# Altium project DK2.PRJPCB (part 1 of 2)
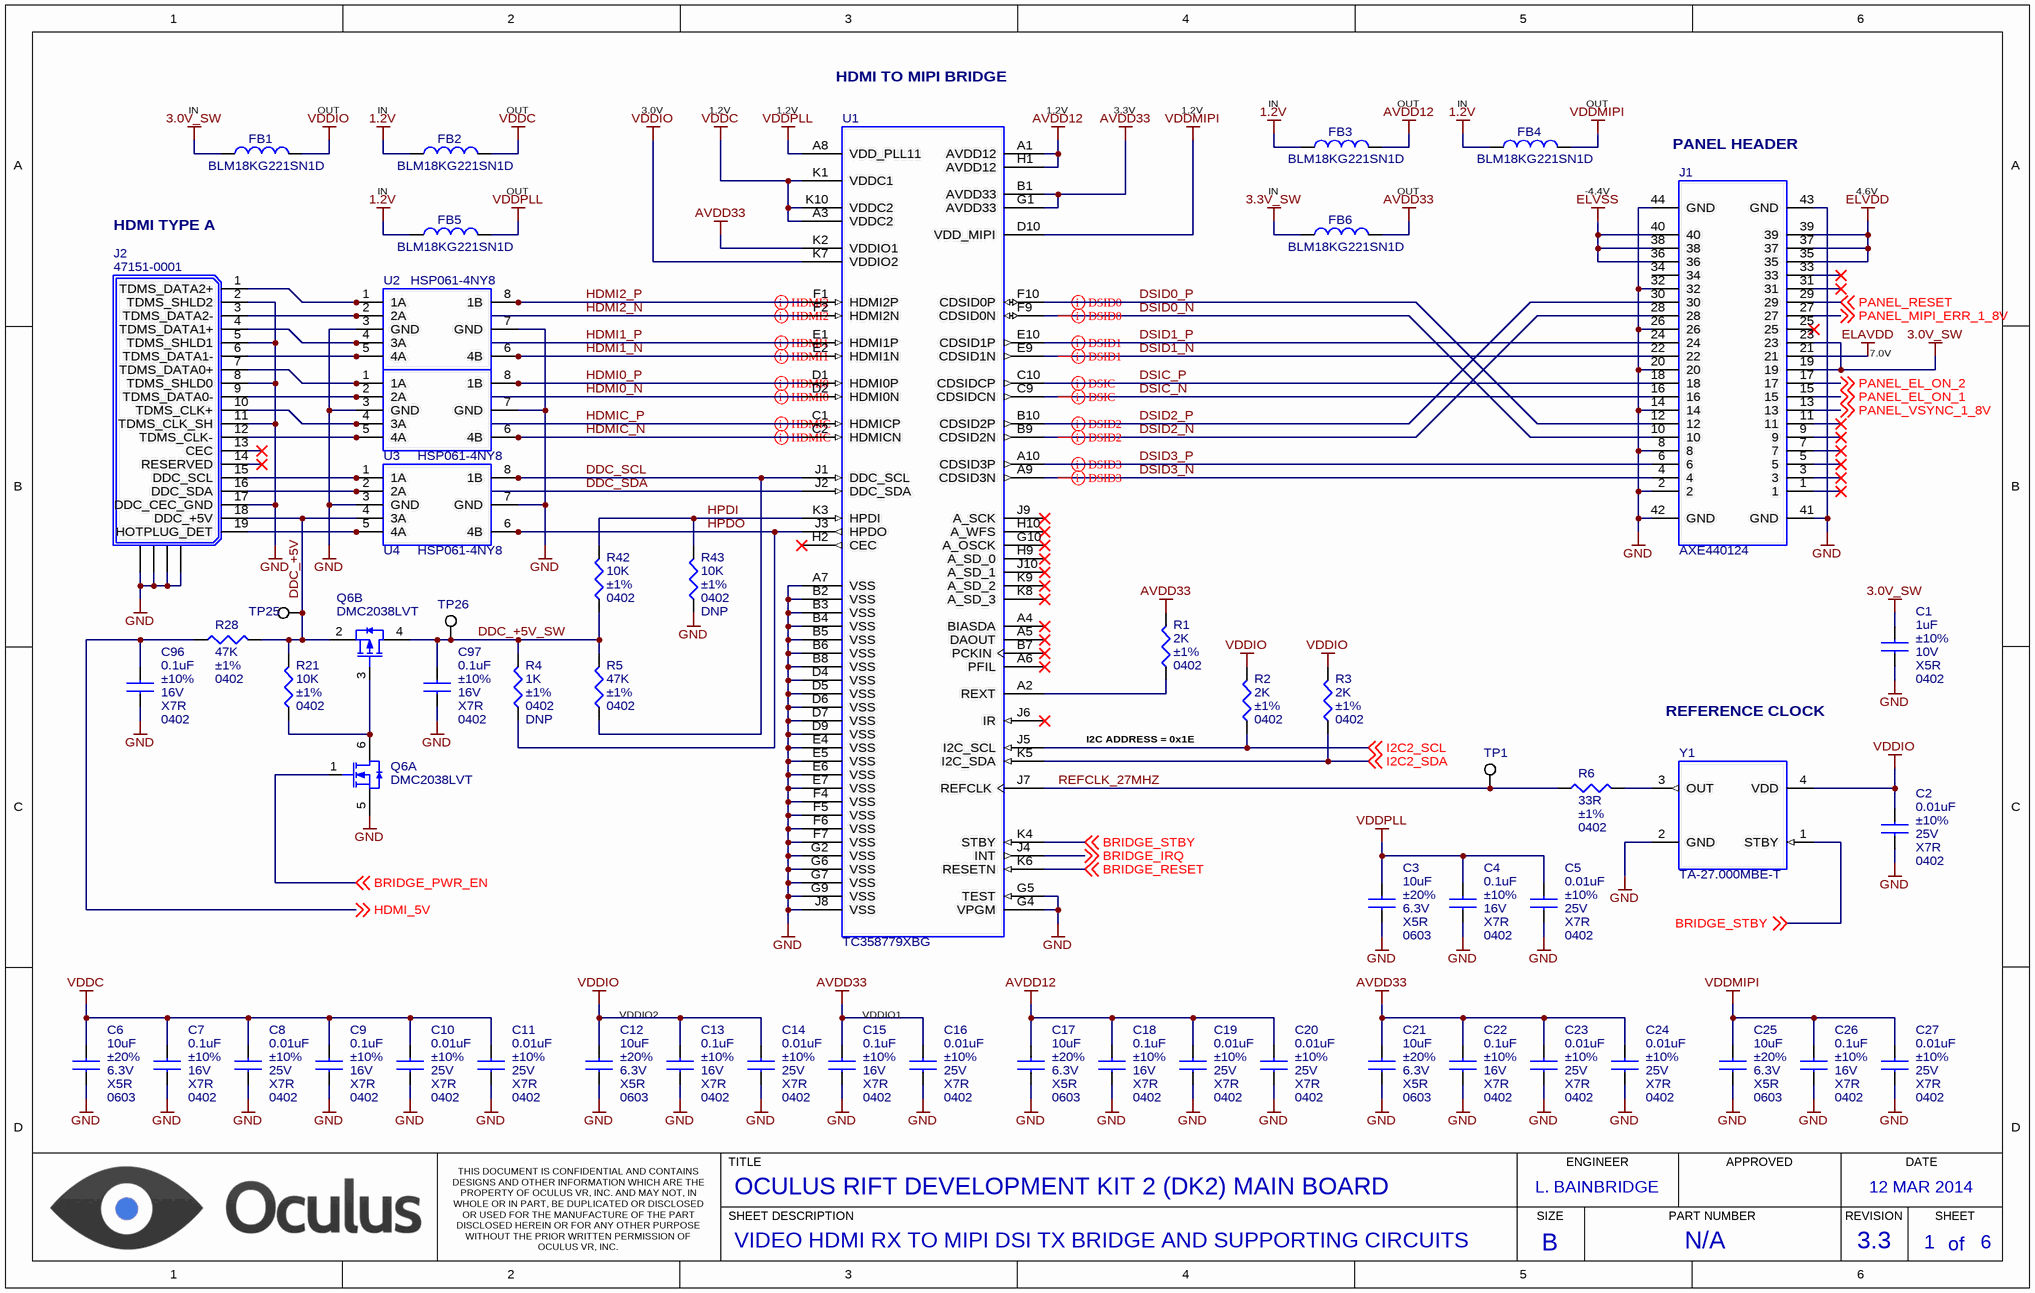
[diagram p0: VIDEO.SchDoc]
Date: 5 Jan 2014
6 sheets, 275 parts. Net scope: global (net labels, ports and power ports of the same name join across sheets).
Board file: DK2.PcbDoc
Sheets:
  VIDEO.SchDoc
  MICRO.SchDoc
  USBHUB.SchDoc
  SENSOR.SchDoc
  POWER.SchDoc
  IRLED.SchDoc

## Sheet VIDEO.SchDoc: OCULUS RIFT DEVELOPMENT KIT 2 (DK2) MAIN BOARD
size B; Date: 12 MAR 2014; Author: L. BAINBRIDGE; CompanyName: Oculus VR, Inc.; DrawnBy: L. BAINBRIDGE; Engineer: L. BAINBRIDGE; Organization: Oculus VR, Inc.; DocumentNumber: 1; Revision: 3.3; SheetNumber: 1; SheetTotal: 6; PageSetup: Record=PageOptions|CenterHorizontal=True|CenterVertical=True|PrintScale=1.12|XCorrection=1.00|YCorrection=1.00|PrintKind=1|BorderSize=5000000|LeftOffset=0|BottomOffset=0|Orientation=2|PaperLength=1000|PaperWidth=1000|Scale=100|PaperSource=15|PrintQuality=1200|MediaType=1|DitherType=0|PaperKind=11 x 17|PrintScaleMode=1; SheetDescription: VIDEO HDMI RX TO MIPI DSI TX BRIDGE AND SUPPORTING CIRCUITS; PartNumber: N/A; ProjectName: DK2

### Parts
C1  1uF  Tolerance: ±10%  Voltage: 10V  Dielectric: X5R  Package: 0402  [CAP_CERAMIC_0402]
C2  0.01uF  Tolerance: ±10%  Voltage: 25V  Dielectric: X7R  Package: 0402  [CAP_CERAMIC_0402]
C3  10uF  Tolerance: ±20%  Voltage: 6.3V  Dielectric: X5R  Package: 0603  [CAP_CERAMIC_0603]
C4  0.1uF  Tolerance: ±10%  Voltage: 16V  Dielectric: X7R  Package: 0402  [CAP_CERAMIC_0402]
C5  0.01uF  Tolerance: ±10%  Voltage: 25V  Dielectric: X7R  Package: 0402  [CAP_CERAMIC_0402]
C6  10uF  Tolerance: ±20%  Voltage: 6.3V  Dielectric: X5R  Package: 0603  [CAP_CERAMIC_0603]
C7  0.1uF  Tolerance: ±10%  Voltage: 16V  Dielectric: X7R  Package: 0402  [CAP_CERAMIC_0402]
C8  0.01uF  Tolerance: ±10%  Voltage: 25V  Dielectric: X7R  Package: 0402  [CAP_CERAMIC_0402]
C9  0.1uF  Tolerance: ±10%  Voltage: 16V  Dielectric: X7R  Package: 0402  [CAP_CERAMIC_0402]
C10  0.01uF  Tolerance: ±10%  Voltage: 25V  Dielectric: X7R  Package: 0402  [CAP_CERAMIC_0402]
C11  0.01uF  Tolerance: ±10%  Voltage: 25V  Dielectric: X7R  Package: 0402  [CAP_CERAMIC_0402]
C12  10uF  Tolerance: ±20%  Voltage: 6.3V  Dielectric: X5R  Package: 0603  [CAP_CERAMIC_0603]
C13  0.1uF  Tolerance: ±10%  Voltage: 16V  Dielectric: X7R  Package: 0402  [CAP_CERAMIC_0402]
C14  0.01uF  Tolerance: ±10%  Voltage: 25V  Dielectric: X7R  Package: 0402  [CAP_CERAMIC_0402]
C15  0.1uF  Tolerance: ±10%  Voltage: 16V  Dielectric: X7R  Package: 0402  [CAP_CERAMIC_0402]
C16  0.01uF  Tolerance: ±10%  Voltage: 25V  Dielectric: X7R  Package: 0402  [CAP_CERAMIC_0402]
C17  10uF  Tolerance: ±20%  Voltage: 6.3V  Dielectric: X5R  Package: 0603  [CAP_CERAMIC_0603]
C18  0.1uF  Tolerance: ±10%  Voltage: 16V  Dielectric: X7R  Package: 0402  [CAP_CERAMIC_0402]
C19  0.01uF  Tolerance: ±10%  Voltage: 25V  Dielectric: X7R  Package: 0402  [CAP_CERAMIC_0402]
C20  0.01uF  Tolerance: ±10%  Voltage: 25V  Dielectric: X7R  Package: 0402  [CAP_CERAMIC_0402]
C21  10uF  Tolerance: ±20%  Voltage: 6.3V  Dielectric: X5R  Package: 0603  [CAP_CERAMIC_0603]
C22  0.1uF  Tolerance: ±10%  Voltage: 16V  Dielectric: X7R  Package: 0402  [CAP_CERAMIC_0402]
C23  0.01uF  Tolerance: ±10%  Voltage: 25V  Dielectric: X7R  Package: 0402  [CAP_CERAMIC_0402]
C24  0.01uF  Tolerance: ±10%  Voltage: 25V  Dielectric: X7R  Package: 0402  [CAP_CERAMIC_0402]
C25  10uF  Tolerance: ±20%  Voltage: 6.3V  Dielectric: X5R  Package: 0603  [CAP_CERAMIC_0603]
C26  0.1uF  Tolerance: ±10%  Voltage: 16V  Dielectric: X7R  Package: 0402  [CAP_CERAMIC_0402]
C27  0.01uF  Tolerance: ±10%  Voltage: 25V  Dielectric: X7R  Package: 0402  [CAP_CERAMIC_0402]
C96  0.1uF  Tolerance: ±10%  Voltage: 16V  Dielectric: X7R  Package: 0402  [CAP_CERAMIC_0402]
C97  0.1uF  Tolerance: ±10%  Voltage: 16V  Dielectric: X7R  Package: 0402  [CAP_CERAMIC_0402]
FB1  BLM18KG221SN1D  [INDUCTOR_0603]
FB2  BLM18KG221SN1D  [INDUCTOR_0603]
FB3  BLM18KG221SN1D  [INDUCTOR_0603]
FB4  BLM18KG221SN1D  [INDUCTOR_0603]
FB5  BLM18KG221SN1D  [INDUCTOR_0603]
FB6  BLM18KG221SN1D  [INDUCTOR_0603]
J1  AXE440124  [AXE440124]
J2  47151-0001  [47151-0001]
Q6  DMC2038LVT  [TSOT26]  (parts A,B of 2)
R1  2K  Package: 0402  Tolerance: ±1%  [RESISTOR_0402]
R2  2K  Package: 0402  Tolerance: ±1%  [RESISTOR_0402]
R3  2K  Package: 0402  Tolerance: ±1%  [RESISTOR_0402]
R4  1K  Package: 0402  Tolerance: ±1%  [RESISTOR_0402]  (no BOM)
R5  47K  Package: 0402  Tolerance: ±1%  [RESISTOR_0402]
R6  33R  Package: 0402  Tolerance: ±1%  [RESISTOR_0402]
R21  10K  Package: 0402  Tolerance: ±1%  [RESISTOR_0402]
R28  47K  Package: 0402  Tolerance: ±1%  [RESISTOR_0402]
R42  10K  Package: 0402  Tolerance: ±1%  [RESISTOR_0402]
R43  10K  Package: 0402  Tolerance: ±1%  [RESISTOR_0402]  (no BOM)
TP1  TEST POINT  [TEST_POINT_PAD_1MM]  (value not drawn)  (no BOM)
TP25  TEST POINT  [TEST_POINT_PAD_1MM]  (value not drawn)  (no BOM)
TP26  TEST POINT  [TEST_POINT_PAD_1MM]  (value not drawn)  (no BOM)
U1  TC358779XBG  [BGA80]
U2  HSP061-4NY8  [HSP061-4NY8]
U3  HSP061-4NY8  [HSP061-4NY8]
U4  HSP061-4NY8  [HSP061-4NY8]
Y1  TA-27.000MBE-T  [TXC_TD]

### Nets
1.2V: FB2.1 FB3.1 FB4.1 FB5.1
3.0V_SW: C1.1 FB1.1 J1.19 J1.23
3.3V_SW: FB6.1
AVDD12: C17.1 C18.1 C19.1 C20.1 FB3.2 U1.A1(AVDD12) U1.H1(AVDD12)
AVDD33: C15.1 C16.1 C21.1 C22.1 C23.1 C24.1 FB6.2 R1.2 U1.B1(AVDD33) U1.G1(AVDD33) U1.K2(VDDIO1)
ELAVDD: J1.21
ELVDD: J1.35 J1.37 J1.39
ELVSS: J1.36 J1.38 J1.40
GND: C1.2 C2.2 C3.2 C4.2 C5.2 C6.2 C7.2 C8.2 C9.2 C10.2 C11.2 C12.2 C13.2 C14.2 C15.2 C16.2 C17.2 C18.2 C19.2 C20.2 C21.2 C22.2 C23.2 C24.2 C25.2 C26.2 C27.2 C96.2 C97.2 J1.2 J1.8 J1.14 J1.20 J1.26 J1.32 J1.41(GND) J1.42(GND) J1.43(GND) J1.44(GND) J2.2(TDMS_SHLD2) J2.5(TDMS_SHLD1) J2.8(TDMS_SHLD0) J2.11(TDMS_CLK_SH) J2.17(DDC_CEC_GND) J2.20(SHIELD) J2.21(SHIELD) J2.22(SHIELD) J2.23(SHIELD) Q6.5(S) R43.1 U1.A7(VSS) U1.B2(VSS) U1.B3(VSS) U1.B4(VSS) U1.B5(VSS) U1.B6(VSS) U1.B8(VSS) U1.D4(VSS) U1.D5(VSS) U1.D6(VSS) U1.D7(VSS) U1.D9(VSS) U1.E4(VSS) U1.E5(VSS) U1.E6(VSS) U1.E7(VSS) U1.F4(VSS) U1.F5(VSS) U1.F6(VSS) U1.F7(VSS) U1.G2(VSS) U1.G4(VPGM) U1.G5(TEST) U1.G6(VSS) U1.G7(VSS) U1.G9(VSS) U1.J8(VSS) U2.3(GND) U2.7(GND) U3.3(GND) U3.7(GND) U4.3(GND) U4.7(GND) Y1.2(GND)
VDDC: C6.1 C7.1 C8.1 C9.1 C10.1 C11.1 FB2.2 U1.A3(VDDC2) U1.K1(VDDC1) U1.K10(VDDC2)
VDDIO: C2.1 C12.1 C13.1 C14.1 FB1.2 R2.2 R3.2 U1.K7(VDDIO2) Y1.4(VDD)
VDDMIPI: C25.1 C26.1 C27.1 FB4.2 U1.D10(VDD_MIPI)
VDDPLL: C3.1 C4.1 C5.1 FB5.2 U1.A8(VDD_PLL11)
BRIDGE_IRQ: U1.J4(INT) ; off-sheet BRIDGE_IRQ
BRIDGE_PWR_EN: Q6.1(G) ; off-sheet BRIDGE_PWR_EN
BRIDGE_RESET: U1.K6(RESETN) ; off-sheet BRIDGE_RESET
BRIDGE_STBY: U1.K4(STBY) Y1.1(STBY) ; off-sheet BRIDGE_STBY
DDC_+5V: J2.18(DDC_+5V) Q6.2(S) R21.2 R28.2 TP25.1 U4.4(3A)
DDC_+5V_SW: C97.1 Q6.4(D) R4.2 R5.2 R42.1 TP26.1
DDC_SCL: J2.15(DDC_SCL) R5.1 U1.J1(DDC_SCL) U4.1(1A) U4.8(1B)
DDC_SDA: J2.16(DDC_SDA) U1.J2(DDC_SDA) U4.2(2A)
DSIC_N: J1.16 U1.C9(CDSIDCN)
DSIC_P: J1.18 U1.C10(CDSIDCP)
DSID0_N: J1.10 U1.F9(CDSID0N)
DSID0_P: J1.12 U1.F10(CDSID0P)
DSID1_N: J1.22 U1.E9(CDSID1N)
DSID1_P: J1.24 U1.E10(CDSID1P)
DSID2_N: J1.28 U1.B9(CDSID2N)
DSID2_P: J1.30 U1.B10(CDSID2P)
DSID3_N: J1.4 U1.A9(CDSID3N)
DSID3_P: J1.6 U1.A10(CDSID3P)
HDMI0_N: J2.9(TDMS_DATA0-) U1.D2(HDMI0N) U3.2(2A)
HDMI0_P: J2.7(TDMS_DATA0+) U1.D1(HDMI0P) U3.1(1A) U3.8(1B)
HDMI1_N: J2.6(TDMS_DATA1-) U1.E2(HDMI1N) U2.5(4A) U2.6(4B)
HDMI1_P: J2.4(TDMS_DATA1+) U1.E1(HDMI1P) U2.4(3A)
HDMI2_N: J2.3(TDMS_DATA2-) U1.F2(HDMI2N) U2.2(2A)
HDMI2_P: J2.1(TDMS_DATA2+) U1.F1(HDMI2P) U2.1(1A) U2.8(1B)
HDMI_5V: C96.1 R28.1 ; off-sheet HDMI_5V
HDMIC_N: J2.12(TDMS_CLK-) U1.C2(HDMICN) U3.5(4A) U3.6(4B)
HDMIC_P: J2.10(TDMS_CLK+) U1.C1(HDMICP) U3.4(3A)
HPDI: R42.2 R43.2 U1.K3(HPDI)
HPDO: J2.19(HOTPLUG_DET) R4.1 U1.J3(HPDO) U4.5(4A) U4.6(4B)
I2C2_SCL: R2.1 U1.J5(I2C_SCL) ; off-sheet I2C2_SCL
I2C2_SDA: R3.1 U1.K5(I2C_SDA) ; off-sheet I2C2_SDA
PANEL_EL_ON_1: J1.15 ; off-sheet PANEL_EL_ON_1
PANEL_EL_ON_2: J1.17 ; off-sheet PANEL_EL_ON_2
PANEL_MIPI_ERR_1_8V: J1.27 ; off-sheet PANEL_MIPI_ERR_1_8V
PANEL_RESET: J1.29 ; off-sheet PANEL_RESET
PANEL_VSYNC_1_8V: J1.13 ; off-sheet PANEL_VSYNC_1_8V
REFCLK_27MHZ: R6.1 TP1.1 U1.J7(REFCLK)
NetQ6_3: Q6.3(G) Q6.6(D) R21.1
NetR1_1: R1.1 U1.A2(REXT)
NetR6_2: R6.2 Y1.3(OUT)

Not connected (* = marked no-connect by the designer): J1 1* 3* 5* 7* 9* 11* 25* 31* 33* 34; J2 13(CEC)* 14(RESERVED)*; U1 A4(BIASDA)* A5(DAOUT)* A6(PFIL)* B7(PCKIN)* G10(A_OSCK)* H2(CEC)* H9(A_SD_0)* H10(A_WFS)* J6(IR)* J9(A_SCK)* J10(A_SD_1)* K8(A_SD_3)* K9(A_SD_2)*

### Layout directives
differential pair: DSIC_N, DSIC_P, DSID0_N, DSID0_P, DSID1_N, DSID1_P, DSID2_N, DSID2_P, DSID3_N, DSID3_P, HDMI0_N, HDMI0_P, HDMI1_N, HDMI1_P, HDMI2_N, HDMI2_P, HDMIC_N, HDMIC_P

### Notes on the sheet
- HDMI TO MIPI BRIDGE
- (near FB3) IN
- (near FB3) OUT
- (near FB4) IN
- (near FB4) OUT
- (near FB1) IN
- (near FB1) OUT
- (near FB2) IN
- (near FB2) OUT
- 3.0V
- 1.2V
- 3.3V
- PANEL HEADER
- HDMI TYPE A
- IN
- OUT
- -4.4V
- 4.6V
- 7.0V
- (near R2) I2C ADDRESS = 0x1E
- REFERENCE CLOCK
- VDDIO2
- VDDIO1
- TITLE
- ENGINEER
- APPROVED
- DATE
- THIS DOCUMENT IS CONFIDENTIAL AND CONTAINS DESIGNS AND OTHER INFORMATION WHICH ARE THE PROPERTY OF OCULUS VR, INC. AND MAY NOT, IN WHOLE OR IN PART, BE DUPLICATED OR DISCLOSED OR USED FOR THE MANUFACTURE OF THE PART DISCLOSED HEREIN OR FOR ANY OTHER PURPOSE WITHOUT THE PRIOR WRITTEN PERMISSION OF OCULUS VR, INC.
- SHEET DESCRIPTION
- SIZE
- PART NUMBER
- REVISION
- SHEET
- of
- B

### Library data of the parts
C1 = CAP, CERAMIC: CAP, CERAMIC, 1uF, ±10%, 10V, X5R, 0402; Manufacturer: MURATA ELECTRONICS; Part Number: GRM155R61A105KE15D
C2 C5 C8 C10 C11 C14 C16 C19 C20 C23 C24 C27 = CAP, CERAMIC: CAP, CERAMIC, 0.01uF, ±10%, 25V, X7R, 0402; Manufacturer: MURATA ELECTRONICS; Part Number: GRM155R71E103KA01D
C3 C6 C12 C17 C21 C25 = CAP, CERAMIC: CAP, CERAMIC, 10uF, ±20%, 6.3V, X5R, 0603; Manufacturer: MURATA ELECTRONICS; Part Number: GRM188R60J106ME47D
C4 C7 C9 C13 C15 C18 C22 C26 C96 C97 = CAP, CERAMIC: CAP, CERAMIC, 0.1uF, ±10%, 16V, X7R, 0402; Manufacturer: MURATA ELECTRONICS; Part Number: GRM155R71C104KA88D
FB1-FB6 = INDUCTOR: FERRITE CHIP BEAD, 220 OHM @ 100MHz, 2.2A, 0603; Manufacturer: MURATA ELECTRONICS; Part Number: BLM18KG221SN1D; Package: 0603; Impedance: 220 ohm @ 100MHz
J1 = AXE440124: CONNECTOR, 40-PIN HEADER, 0.4MM PITCH; Manufacturer: PANASONIC; Part Number: AXE440124; Verified Pinout: *
J2 = 47151-0001: CONNECTOR, HDMI TYPE A, R/A, SMD; Manufacturer: MOLEX; Part Number: 47151-0001
Q6 = DMC2038LVT: FET, COMPLEMENTARY, LOGIC LEVEL; Manufacturer: DIODES INC; Part Number: DMC2038LVT
R1-R3 = RESISTOR: RES, 2K OHM, 1/10W, ±1%, 0402; Manufacturer: PANASONIC; Part Number: ERJ-2RKF2001X; Power Rating: 1/10W
R4 = RESISTOR: RES, 1K OHM, 1/10W, ±1%, 0402; Manufacturer: PANASONIC; Part Number: ERJ-2RKF1001X; Power Rating: 1/10W; DNP: DNP
R5 R28 = RESISTOR: RES, 47K OHM, 1/10W, ±1%, 0402; Manufacturer: PANASONIC; Part Number: ERJ-2RKF4702X; Power Rating: 1/10W
R6 = RESISTOR: RES, 33 OHM, 1/10W, ±1%, 0402; Manufacturer: PANASONIC; Part Number: ERJ-2RKF33R0X; Power Rating: 1/10W
R21 R42 R43 = RESISTOR: RES, 10K OHM, 1/10W, ±1%, 0402; Manufacturer: PANASONIC; Part Number: ERJ-2RKF1002X; Power Rating: 1/10W
  R43: DNP: DNP
TP1 TP25 TP26 = TEST_POINT_GENERIC: Manufacturer: *; Part Number: *
U1 = TC358779XBG: IC, HDMI RX TO MIPI DSI TX BRIDGE; Manufacturer: TOSHIBA; Part Number: TC358779XBG; Verified Pinout: *
U2-U4 = HSP061-4NY8: IC, 4-LINE ESD PROTECTION ARRAY, HIGH SPEED; Manufacturer: STMICROELECTRONICS; Part Number: HSP061-4NY8; Verified Pinout: *
Y1 = TA-27.000MBE-T: OSCILLATOR, 27MHz, MEMS, 3.3V, 50PPM; Manufacturer: TXC; Part Number: TA-27.000MBE-T; Verified Pinout: *

## Sheet MICRO.SchDoc: OCULUS RIFT DEVELOPMENT KIT 2 (DK2) MAIN BOARD
size B; Date: 12 MAR 2014; Author: L. BAINBRIDGE; CompanyName: Oculus VR, Inc.; DrawnBy: L. BAINBRIDGE; Engineer: L. BAINBRIDGE; Organization: Oculus VR, Inc.; DocumentNumber: 2; Revision: 3.3; SheetNumber: 2; SheetTotal: 6; PageSetup: Record=PageOptions|CenterHorizontal=True|CenterVertical=True|PrintScale=1.12|XCorrection=1.00|YCorrection=1.00|PrintKind=1|BorderSize=5000000|LeftOffset=0|BottomOffset=0|Orientation=2|PaperLength=1000|PaperWidth=1000|Scale=100|PaperSource=15|PrintQuality=1200|MediaType=1|DitherType=0|PaperKind=11 x 17|PrintScaleMode=1; SheetDescription: MICROCONTROLLER AND SUPPORTING CIRCUITS; PartNumber: N/A; ProjectName: DK2
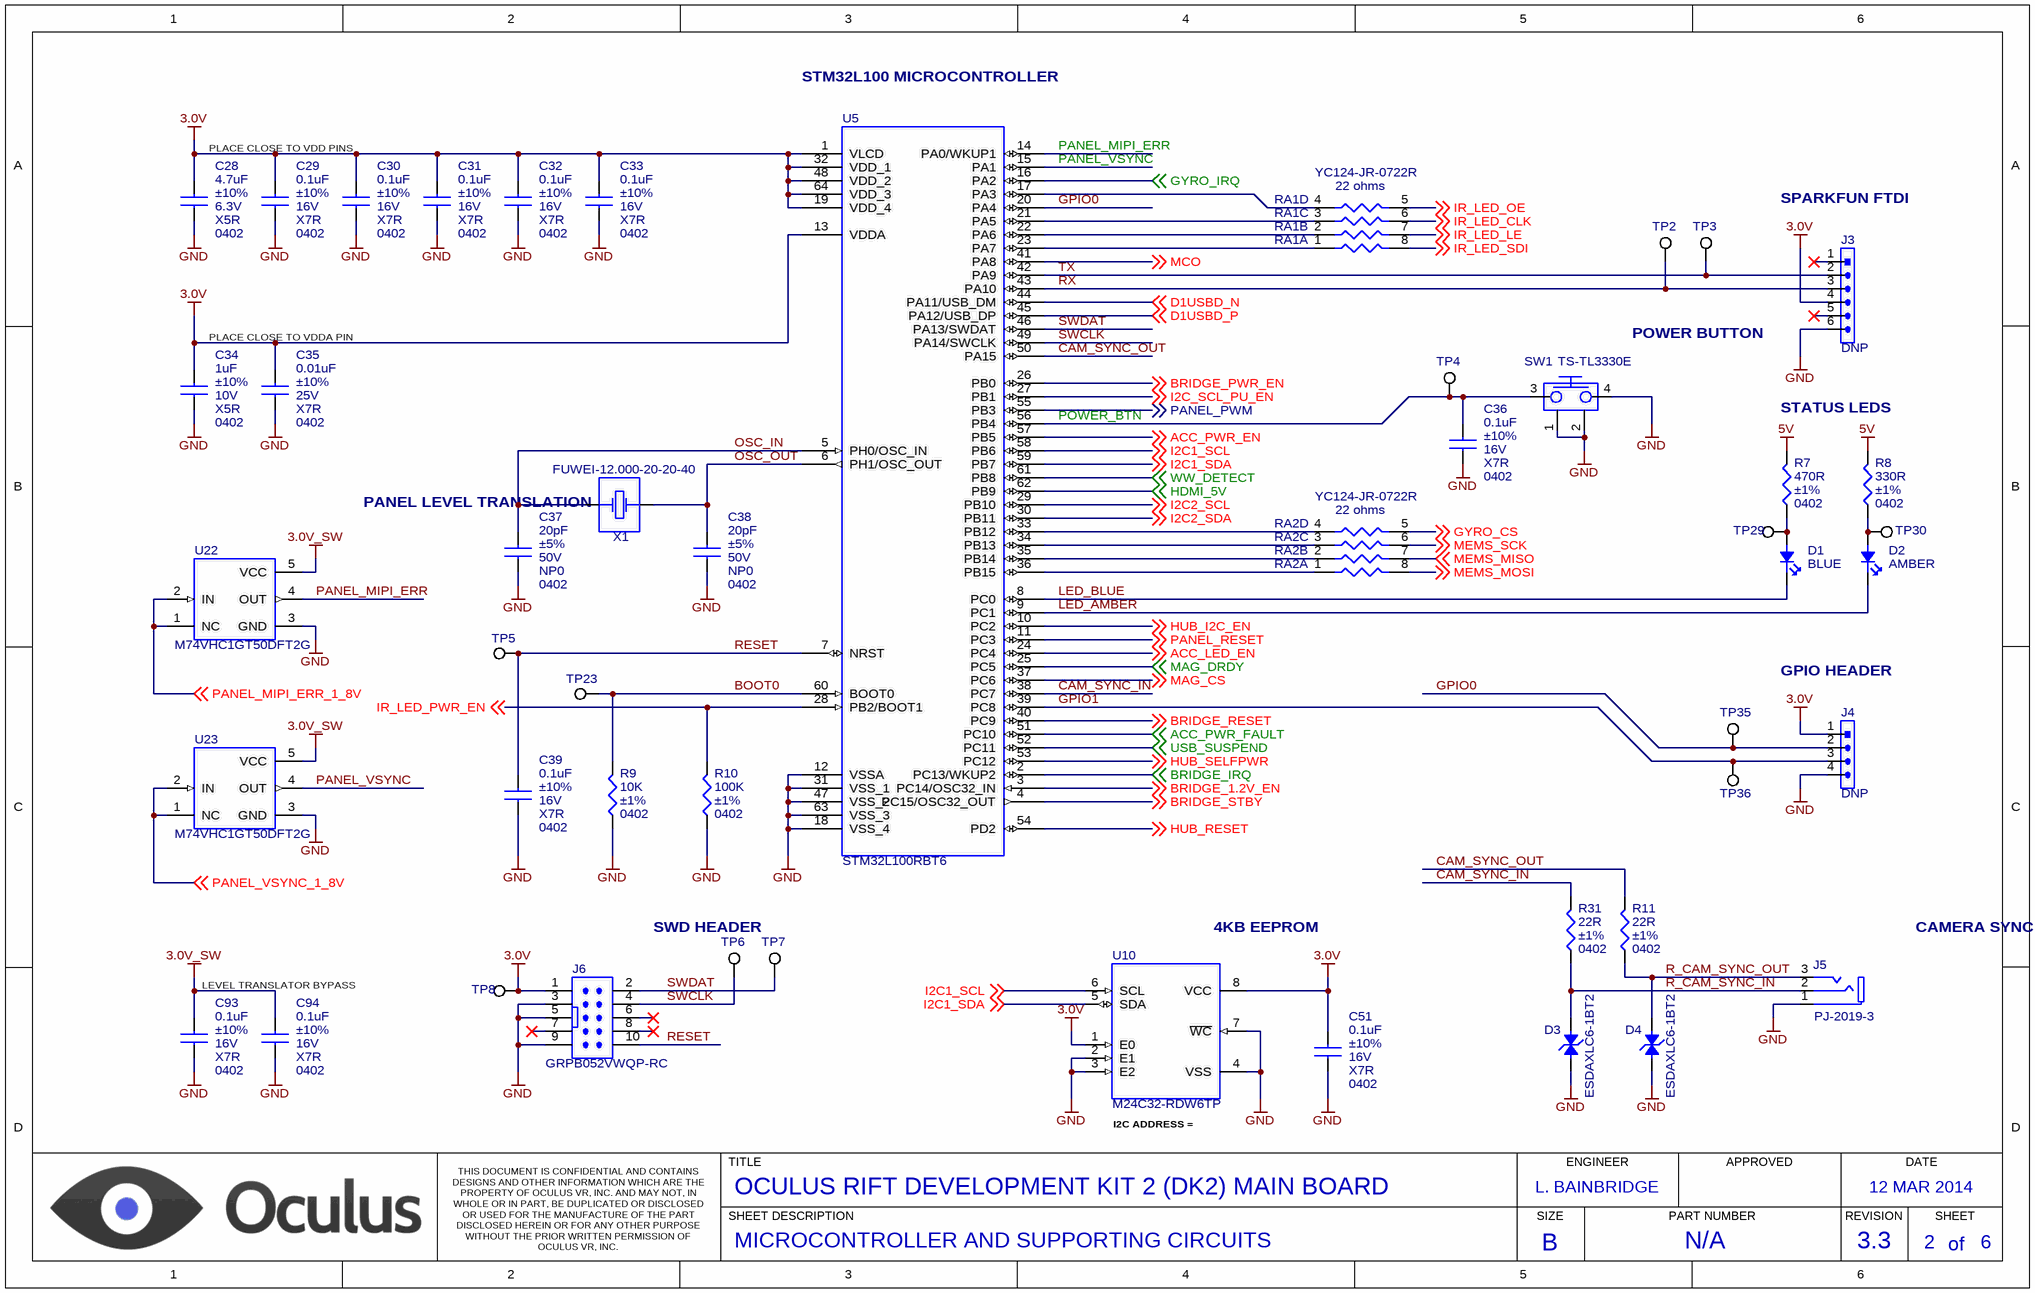
[diagram p1: MICRO.SchDoc]

### Parts
C28  4.7uF  Tolerance: ±10%  Voltage: 6.3V  Dielectric: X5R  Package: 0402  [CAP_CERAMIC_0402]
C29  0.1uF  Tolerance: ±10%  Voltage: 16V  Dielectric: X7R  Package: 0402  [CAP_CERAMIC_0402]
C30  0.1uF  Tolerance: ±10%  Voltage: 16V  Dielectric: X7R  Package: 0402  [CAP_CERAMIC_0402]
C31  0.1uF  Tolerance: ±10%  Voltage: 16V  Dielectric: X7R  Package: 0402  [CAP_CERAMIC_0402]
C32  0.1uF  Tolerance: ±10%  Voltage: 16V  Dielectric: X7R  Package: 0402  [CAP_CERAMIC_0402]
C33  0.1uF  Tolerance: ±10%  Voltage: 16V  Dielectric: X7R  Package: 0402  [CAP_CERAMIC_0402]
C34  1uF  Tolerance: ±10%  Voltage: 10V  Dielectric: X5R  Package: 0402  [CAP_CERAMIC_0402]
C35  0.01uF  Tolerance: ±10%  Voltage: 25V  Dielectric: X7R  Package: 0402  [CAP_CERAMIC_0402]
C36  0.1uF  Tolerance: ±10%  Voltage: 16V  Dielectric: X7R  Package: 0402  [CAP_CERAMIC_0402]
C37  20pF  Tolerance: ±5%  Voltage: 50V  Dielectric: NP0  Package: 0402  [CAP_CERAMIC_0402]
C38  20pF  Tolerance: ±5%  Voltage: 50V  Dielectric: NP0  Package: 0402  [CAP_CERAMIC_0402]
C39  0.1uF  Tolerance: ±10%  Voltage: 16V  Dielectric: X7R  Package: 0402  [CAP_CERAMIC_0402]
C51  0.1uF  Tolerance: ±10%  Voltage: 16V  Dielectric: X7R  Package: 0402  [CAP_CERAMIC_0402]
C93  0.1uF  Tolerance: ±10%  Voltage: 16V  Dielectric: X7R  Package: 0402  [CAP_CERAMIC_0402]
C94  0.1uF  Tolerance: ±10%  Voltage: 16V  Dielectric: X7R  Package: 0402  [CAP_CERAMIC_0402]
D1  Color: BLUE  [LED_BLUE_0603]  (hidden comment: LED)
D2  Color: AMBER  [LED_AMBER_0603]  (hidden comment: LED)
D3  ESDAXLC6-1BT2  [SOD-882T]
D4  ESDAXLC6-1BT2  [SOD-882T]
J3  DNP  [HEADER_1X6]  (no BOM)
J4  DNP  [HEADER_1X4]  (no BOM)
J5  PJ-2019-3  [PJ-2019-3]
J6  GRPB052VWQP-RC  [GRPB052VWQP-RC]  (no BOM)
R7  470R  Package: 0402  Tolerance: ±1%  [RESISTOR_0402]
R8  330R  Package: 0402  Tolerance: ±1%  [RESISTOR_0402]
R9  10K  Package: 0402  Tolerance: ±1%  [RESISTOR_0402]
R10  100K  Package: 0402  Tolerance: ±1%  [RESISTOR_0402]
R11  22R  Package: 0402  Tolerance: ±1%  [RESISTOR_0402]
R31  22R  Package: 0402  Tolerance: ±1%  [RESISTOR_0402]
RA1  YC124-JR-0722R  value 22 ohms  [YC124]  (parts A,B,C,D of 4)
RA2  YC124-JR-0722R  value 22 ohms  [YC124]  (parts A,B,C,D of 4)
SW1  TS-TL3330E  [TS-TL3330E]
TP2  TEST POINT  [TEST_POINT_PAD_1.2X3MM]  (value not drawn)  (no BOM)
TP3  TEST POINT  [TEST_POINT_PAD_1.2X3MM]  (value not drawn)  (no BOM)
TP4  TEST POINT  [TEST_POINT_PAD_1MM]  (value not drawn)  (no BOM)
TP5  TEST POINT  [TEST_POINT_PAD_1MM]  (value not drawn)  (no BOM)
TP6  TEST POINT  [TEST_POINT_PAD_1MM]  (value not drawn)  (no BOM)
TP7  TEST POINT  [TEST_POINT_PAD_1MM]  (value not drawn)  (no BOM)
TP8  TEST POINT  [TEST_POINT_PAD_1MM]  (value not drawn)  (no BOM)
TP23  TEST POINT  [TEST_POINT_PAD_1MM]  (value not drawn)  (no BOM)
TP29  TEST POINT  [TEST_POINT_PAD_1MM]  (value not drawn)  (no BOM)
TP30  TEST POINT  [TEST_POINT_PAD_1MM]  (value not drawn)  (no BOM)
TP35  TEST POINT  [TEST_POINT_PAD_1.2X3MM]  (value not drawn)  (no BOM)
TP36  TEST POINT  [TEST_POINT_PAD_1MM]  (value not drawn)  (no BOM)
U5  STM32L100RBT6  [LQFP64]
U10  M24C32-RDW6TP  [TSSOP8]
U22  M74VHC1GT50DFT2G  [SC70-5]
U23  M74VHC1GT50DFT2G  [SC70-5]
X1  FUWEI-12.000-20-20-40  [HC-49USX]

### Nets
3.0V: C28.1 C29.1 C30.1 C31.1 C32.1 C33.1 C34.1 C35.1 C51.1 J3.4 J4.1 J6.1 TP8.1 U5.1(VLCD) U5.13(VDDA) U5.19(VDD_4) U5.32(VDD_1) U5.48(VDD_2) U5.64(VDD_3) U10.1(E0) U10.8(VCC)
3.0V_SW: C93.1 C94.1 U22.5(VCC) U23.5(VCC)
5V: R7.2 R8.2
GND: C28.2 C29.2 C30.2 C31.2 C32.2 C33.2 C34.2 C35.2 C36.2 C37.2 C38.2 C39.2 C51.2 C93.2 C94.2 D3.2 D4.2 J3.6 J4.4 J5.1 J6.3 J6.5 J6.9 R9.1 R10.1 SW1.1 SW1.2 SW1.4 U5.12(VSSA) U5.18(VSS_4) U5.31(VSS_1) U5.47(VSS_2) U5.63(VSS_3) U10.2(E1) U10.3(E2) U10.4(VSS) U10.7(~{WC}) U22.3(GND) U23.3(GND)
ACC_LED_EN: U5.24(PC4) ; off-sheet ACC_LED_EN
ACC_PWR_EN: U5.57(PB5) ; off-sheet ACC_PWR_EN
ACC_PWR_FAULT: U5.51(PC10) ; off-sheet ACC_PWR_FAULT
BOOT0: R9.2 TP23.1 U5.60(BOOT0)
BRIDGE_1.2V_EN: U5.3(PC14/OSC32_IN) ; off-sheet BRIDGE_1.2V_EN
BRIDGE_IRQ: U5.2(PC13/WKUP2) ; off-sheet BRIDGE_IRQ
BRIDGE_PWR_EN: U5.26(PB0) ; off-sheet BRIDGE_PWR_EN
BRIDGE_RESET: U5.40(PC9) ; off-sheet BRIDGE_RESET
BRIDGE_STBY: U5.4(PC15/OSC32_OUT) ; off-sheet BRIDGE_STBY
CAM_SYNC_IN: R31.1 U5.38(PC7)
CAM_SYNC_OUT: R11.1 U5.50(PA15)
D1USBD_N: U5.44(PA11/USB_DM) ; off-sheet D1USBD_N
D1USBD_P: U5.45(PA12/USB_DP) ; off-sheet D1USBD_P
GPIO0: J4.2 TP35.1 U5.20(PA4)
GPIO1: J4.3 TP36.1 U5.39(PC8)
GYRO_CS: RA2.5 ; off-sheet GYRO_CS
GYRO_IRQ: U5.16(PA2) ; off-sheet GYRO_IRQ
HDMI_5V: U5.62(PB9) ; off-sheet HDMI_5V
HUB_I2C_EN: U5.10(PC2) ; off-sheet HUB_I2C_EN
HUB_RESET: U5.54(PD2) ; off-sheet HUB_RESET
HUB_SELFPWR: U5.53(PC12) ; off-sheet HUB_SELFPWR
I2C1_SCL: U5.58(PB6) U10.6(SCL) ; off-sheet I2C1_SCL
I2C1_SDA: U5.59(PB7) U10.5(SDA) ; off-sheet I2C1_SDA
I2C2_SCL: U5.29(PB10) ; off-sheet I2C2_SCL
I2C2_SDA: U5.30(PB11) ; off-sheet I2C2_SDA
I2C_SCL_PU_EN: U5.27(PB1) ; off-sheet I2C_SCL_PU_EN
IR_LED_CLK: RA1.6 ; off-sheet IR_LED_CLK
IR_LED_LE: RA1.7 ; off-sheet IR_LED_LE
IR_LED_OE: RA1.5 ; off-sheet IR_LED_OE
IR_LED_PWR_EN: R10.2 U5.28(PB2/BOOT1) ; off-sheet IR_LED_PWR_EN
IR_LED_SDI: RA1.8 ; off-sheet IR_LED_SDI
LED_AMBER: D2.2(K) U5.9(PC1)
LED_BLUE: D1.2(K) U5.8(PC0)
MAG_CS: U5.37(PC6) ; off-sheet MAG_CS
MAG_DRDY: U5.25(PC5) ; off-sheet MAG_DRDY
MCO: U5.41(PA8) ; off-sheet MCO
MEMS_MISO: RA2.7 ; off-sheet MEMS_MISO
MEMS_MOSI: RA2.8 ; off-sheet MEMS_MOSI
MEMS_SCK: RA2.6 ; off-sheet MEMS_SCK
OSC_IN: C37.1 U5.5(PH0/OSC_IN) X1.1
OSC_OUT: C38.1 U5.6(PH1/OSC_OUT) X1.2
PANEL_MIPI_ERR: U5.14(PA0/WKUP1) U22.4(OUT)
PANEL_MIPI_ERR_1_8V: U22.1(NC) U22.2(IN) ; off-sheet PANEL_MIPI_ERR_1_8V
PANEL_PWM: U5.55(PB3) ; off-sheet PANEL_PWM
PANEL_RESET: U5.11(PC3) ; off-sheet PANEL_RESET
PANEL_VSYNC: U5.15(PA1) U23.4(OUT)
PANEL_VSYNC_1_8V: U23.1(NC) U23.2(IN) ; off-sheet PANEL_VSYNC_1_8V
POWER_BTN: C36.1 SW1.3 TP4.1 U5.56(PB4)
R_CAM_SYNC_IN: D3.1 J5.2 R31.2
R_CAM_SYNC_OUT: D4.1 J5.3 R11.2
RESET: C39.1 J6.10 TP5.1 U5.7(NRST)
RX: J3.3 TP2.1 U5.43(PA10)
SWCLK: J6.4 TP6.1 U5.49(PA14/SWCLK)
SWDAT: J6.2 TP7.1 U5.46(PA13/SWDAT)
TX: J3.2 TP3.1 U5.42(PA9)
USB_SUSPEND: U5.52(PC11) ; off-sheet USB_SUSPEND
WW_DETECT: U5.61(PB8) ; off-sheet WW_DETECT
NetD1_1: D1.1(A) R7.1 TP29.1
NetD2_1: D2.1(A) R8.1 TP30.1
NetRA1_1: RA1.1 U5.23(PA7)
NetRA1_2: RA1.2 U5.22(PA6)
NetRA1_3: RA1.3 U5.21(PA5)
NetRA1_4: RA1.4 U5.17(PA3)
NetRA2_1: RA2.1 U5.36(PB15)
NetRA2_2: RA2.2 U5.35(PB14)
NetRA2_3: RA2.3 U5.34(PB13)
NetRA2_4: RA2.4 U5.33(PB12)

Not connected (* = marked no-connect by the designer): J3 1* 5*; J6 6* 7* 8*

### Notes on the sheet
- STM32L100 MICROCONTROLLER
- PLACE CLOSE TO VDD PINS
- SPARKFUN FTDI
- PLACE CLOSE TO VDDA PIN
- POWER BUTTON
- STATUS LEDS
- PANEL LEVEL TRANSLATION
- GPIO HEADER
- SWD HEADER
- 4KB EEPROM
- (near J5) CAMERA SYNC JACK
- LEVEL TRANSLATOR BYPASS CAPS
- (near U10) I2C ADDRESS = 0xA2
- TITLE
- ENGINEER
- APPROVED
- DATE
- THIS DOCUMENT IS CONFIDENTIAL AND CONTAINS DESIGNS AND OTHER INFORMATION WHICH ARE THE PROPERTY OF OCULUS VR, INC. AND MAY NOT, IN WHOLE OR IN PART, BE DUPLICATED OR DISCLOSED OR USED FOR THE MANUFACTURE OF THE PART DISCLOSED HEREIN OR FOR ANY OTHER PURPOSE WITHOUT THE PRIOR WRITTEN PERMISSION OF OCULUS VR, INC.
- SHEET DESCRIPTION
- SIZE
- PART NUMBER
- REVISION
- SHEET
- of
- B

### Library data of the parts
C28 = CAP, CERAMIC: CAP, CERAMIC, 4.7uF, ±10%, 6.3V, X5R, 0402; Manufacturer: TDK CORPORATION; Part Number: C1005X5R0J475K
C29-C33 C36 C39 C51 C93 C94 = CAP, CERAMIC: as C4 on sheet VIDEO
C34 = CAP, CERAMIC: as C1 on sheet VIDEO
C35 = CAP, CERAMIC: as C2 on sheet VIDEO
C37 C38 = CAP, CERAMIC: CAP, CERAMIC, 20pF, ±5%, 50V, NP0, 0402; Manufacturer: MURATA ELECTRONICS; Part Number: GRM1555C1H200JA01D
D1 = LED: LED, BLUE, 0603; Manufacturer: PANASONIC; Part Number: LNJ926W8CRA; Forward Voltage Drop: 2.9V TYP, 3.15V MAX
D2 = LED: LED, AMBER, 0603; Manufacturer: PANASONIC; Part Number: LNJ437W84RA; Forward Voltage Drop: 1.95V TYP, 2.5V MAX
D3 D4 = ESDAXLC6-1BT2: DIODE, ESD SUPPRESSOR, SINGLE LINE BI-DIRECTIONAL, LOW CAPACITANCE; Manufacturer: ST MICROELECTRONICS; Part Number: ESDAXLC6-1BT2
J3 = HEADER 1X6: CONNECTOR, HEADER, 6 POS, 1X6, 0.1" PITCH; Manufacturer: TBD; Part Number: TBD; Pitch: 0.1"
J4 = HEADER 1X4: CONNECTOR, HEADER, 4 POS, 1X4, 0.1" PITCH; Manufacturer: TBD; Part Number: TBD; Pitch: 0.1"
J5 = PJ-2019-3: CONNECTOR, 2.5MM STEREO AUDIO JACK; Manufacturer: BERWAY TECHNOLOGY; Part Number: PJ-2019-3
J6 = GRPB052VWQP-RC: CONNECTOR, 10 POS, ARM CORTEX SWD HEADER; Manufacturer: SULLINS CONNECTOR; Part Number: GRPB052VWQP-RC
R7 = RESISTOR: RES, 470 OHM, 1/10W, ±1%, 0402; Manufacturer: PANASONIC; Part Number: ERJ-2RKF4700X; Power Rating: 1/10W
R8 = RESISTOR: RES, 330 OHM, 1/10W, ±1%, 0402; Manufacturer: PANASONIC; Part Number: ERJ-2RKF3300X; Power Rating: 1/10W
R9 = RESISTOR: as R21 on sheet VIDEO; Power Rating: 1/10W
R10 = RESISTOR: RES, 100K OHM, 1/10W, ±1%, 0402; Manufacturer: PANASONIC; Part Number: ERJ-2RKF1003X; Power Rating: 1/10W
R11 R31 = RESISTOR: RES, 22 OHM, 1/10W, ±1%, 0402; Manufacturer: PANASONIC; Part Number: ERJ-2RKF22R0X; Power Rating: 1/10W
RA1 RA2 = YC124-JR-0722R: RESISTOR ARRAY, 4 RESISTORS, 22 OHM, 5%, 0.5MM PITCH; Manufacturer: YAGEO; Part Number: YC124-JR-0722R; Pinout verified: *
SW1 = TS-TL3330E: SWITCH, TACTILE, SPST-NO, 250gf; Manufacturer: BERWAY TECHNOLOGY; Part Number: TS-TL3330E
TP2-TP8 TP23 TP29 TP30 TP35 TP36 = TEST_POINT_GENERIC: Manufacturer: *; Part Number: *
U5 = STM32L100RBT6: IC, STM32L MICROCONTROLLER, ARM CORTEX M3; Manufacturer: ST MICROELECTRONICS; Part Number: STM32L100RBT6; Verified Pinout: *
U10 = M24C32-RDW6TP: IC, EEPROM, I2C, 32 Kbits; Manufacturer: STMICROELECTRONICS; Part Number: M24C32-RDW6TP; Verified Pinout: *
U22 U23 = M74VHC1GT50DFT2G: IC, NON-INVERTING BUFFER, CMOS LOGIC LEVEL SHIFTER; Manufacturer: ON SEMICONDUCTOR; Part Number: M74VHC1GT50DFT2G; Pinout verified: *
X1 = FUWEI-12.000-20-20-40: CRYSTAL, 12MHZ, +/-30PPM, 20pF, HC-49USX; Manufacturer: BERWAY TECHNOLOGY; Part Number: FUWEI-12.000-20-20-40; Pinout Verified: *

## Sheet USBHUB.SchDoc: OCULUS RIFT DEVELOPMENT KIT 2 (DK2) MAIN BOARD
size B; Date: 12 MAR 2014; Author: L. BAINBRIDGE; CompanyName: Oculus VR, Inc.; DrawnBy: L. BAINBRIDGE; Engineer: L. BAINBRIDGE; Organization: Oculus VR, Inc.; DocumentNumber: 3; Revision: 3.3; SheetNumber: 3; SheetTotal: 6; PageSetup: Record=PageOptions|CenterHorizontal=True|CenterVertical=True|PrintScale=1.12|XCorrection=1.00|YCorrection=1.00|PrintKind=1|BorderSize=5000000|LeftOffset=0|BottomOffset=0|Orientation=2|PaperLength=1000|PaperWidth=1000|Scale=100|PaperSource=15|PrintQuality=1200|MediaType=1|DitherType=0|PaperKind=11 x 17|PrintScaleMode=1; SheetDescription: USB HIGH SPEED HUB AND SUPPORTING CIRCUITS; PartNumber: N/A; ProjectName: DK2
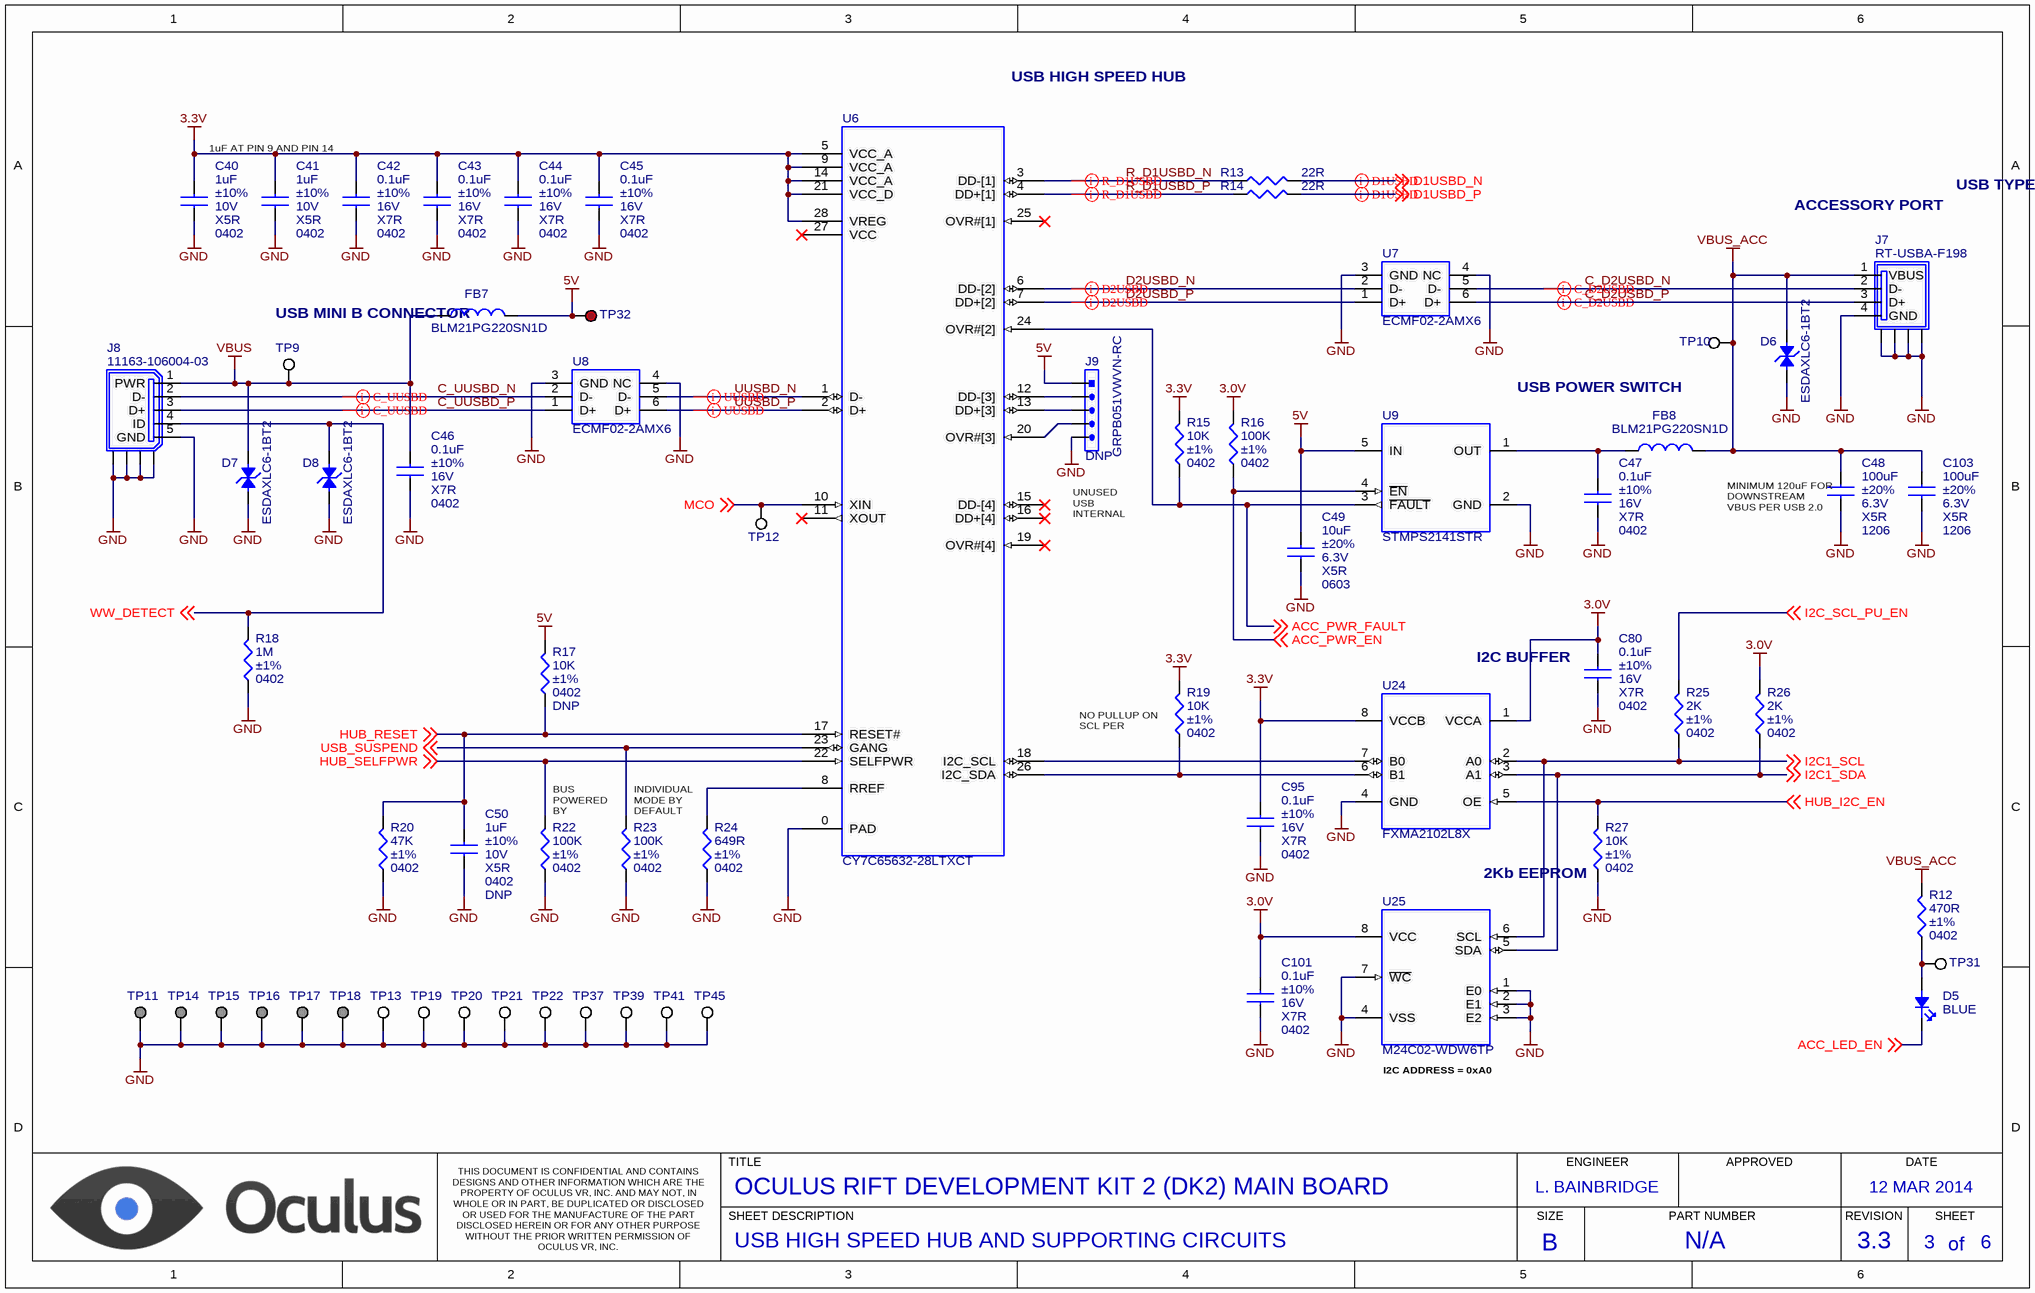
[diagram p2: USBHUB.SchDoc]

### Parts
C40  1uF  Tolerance: ±10%  Voltage: 10V  Dielectric: X5R  Package: 0402  [CAP_CERAMIC_0402]
C41  1uF  Tolerance: ±10%  Voltage: 10V  Dielectric: X5R  Package: 0402  [CAP_CERAMIC_0402]
C42  0.1uF  Tolerance: ±10%  Voltage: 16V  Dielectric: X7R  Package: 0402  [CAP_CERAMIC_0402]
C43  0.1uF  Tolerance: ±10%  Voltage: 16V  Dielectric: X7R  Package: 0402  [CAP_CERAMIC_0402]
C44  0.1uF  Tolerance: ±10%  Voltage: 16V  Dielectric: X7R  Package: 0402  [CAP_CERAMIC_0402]
C45  0.1uF  Tolerance: ±10%  Voltage: 16V  Dielectric: X7R  Package: 0402  [CAP_CERAMIC_0402]
C46  0.1uF  Tolerance: ±10%  Voltage: 16V  Dielectric: X7R  Package: 0402  [CAP_CERAMIC_0402]
C47  0.1uF  Tolerance: ±10%  Voltage: 16V  Dielectric: X7R  Package: 0402  [CAP_CERAMIC_0402]
C48  100uF  Tolerance: ±20%  Voltage: 6.3V  Dielectric: X5R  Package: 1206  [CAP_CERAMIC_1206]
C49  10uF  Tolerance: ±20%  Voltage: 6.3V  Dielectric: X5R  Package: 0603  [CAP_CERAMIC_0603]
C50  1uF  Tolerance: ±10%  Voltage: 10V  Dielectric: X5R  Package: 0402  [CAP_CERAMIC_0402]  (no BOM)
C80  0.1uF  Tolerance: ±10%  Voltage: 16V  Dielectric: X7R  Package: 0402  [CAP_CERAMIC_0402]
C95  0.1uF  Tolerance: ±10%  Voltage: 16V  Dielectric: X7R  Package: 0402  [CAP_CERAMIC_0402]
C101  0.1uF  Tolerance: ±10%  Voltage: 16V  Dielectric: X7R  Package: 0402  [CAP_CERAMIC_0402]
C103  100uF  Tolerance: ±20%  Voltage: 6.3V  Dielectric: X5R  Package: 1206  [CAP_CERAMIC_1206]
D5  Color: BLUE  [LED_BLUE_0603]  (hidden comment: LED)
D6  ESDAXLC6-1BT2  [SOD-882T]
D7  ESDAXLC6-1BT2  [SOD-882T]
D8  ESDAXLC6-1BT2  [SOD-882T]
FB7  BLM21PG220SN1D  [INDUCTOR_0805]
FB8  BLM21PG220SN1D  [INDUCTOR_0805]
J7  RT-USBA-F198  [RT-USBA-F198]
J8  11163-106004-03  [BW_11163-106004-03]
J9  GRPB051VWVN-RC  [GRPB051VWVN-RC]  (no BOM)
R12  470R  Package: 0402  Tolerance: ±1%  [RESISTOR_0402]
R13  22R  [RESISTOR_0402]
R14  22R  [RESISTOR_0402]
R15  10K  Package: 0402  Tolerance: ±1%  [RESISTOR_0402]
R16  100K  Package: 0402  Tolerance: ±1%  [RESISTOR_0402]
R17  10K  Package: 0402  Tolerance: ±1%  [RESISTOR_0402]  (no BOM)
R18  1M  Package: 0402  Tolerance: ±1%  [RESISTOR_0402]
R19  10K  Package: 0402  Tolerance: ±1%  [RESISTOR_0402]
R20  47K  Package: 0402  Tolerance: ±1%  [RESISTOR_0402]
R22  100K  Package: 0402  Tolerance: ±1%  [RESISTOR_0402]
R23  100K  Package: 0402  Tolerance: ±1%  [RESISTOR_0402]
R24  649R  Package: 0402  Tolerance: ±1%  [RESISTOR_0402]
R25  2K  Package: 0402  Tolerance: ±1%  [RESISTOR_0402]
R26  2K  Package: 0402  Tolerance: ±1%  [RESISTOR_0402]
R27  10K  Package: 0402  Tolerance: ±1%  [RESISTOR_0402]
TP9  TEST POINT  [TEST_POINT_PAD_1.2X3MM]  (value not drawn)  (no BOM)
TP10  TEST POINT  [TEST_POINT_PAD_1MM]  (value not drawn)  (no BOM)
TP11  TEST POINT BLACK  [KS_5001_TEST_POINT_BLACK]  (value not drawn)  (no BOM)
TP12  TEST POINT  [TEST_POINT_PAD_1MM]  (value not drawn)  (no BOM)
TP13  TEST POINT  [TEST_POINT_PAD_1.2X3MM]  (value not drawn)  (no BOM)
TP14  TEST POINT BLACK  [KS_5001_TEST_POINT_BLACK]  (value not drawn)  (no BOM)
TP15  TEST POINT BLACK  [KS_5001_TEST_POINT_BLACK]  (value not drawn)  (no BOM)
TP16  TEST POINT BLACK  [KS_5001_TEST_POINT_BLACK]  (value not drawn)  (no BOM)
TP17  TEST POINT BLACK  [KS_5001_TEST_POINT_BLACK]  (value not drawn)  (no BOM)
TP18  TEST POINT BLACK  [KS_5001_TEST_POINT_BLACK]  (value not drawn)  (no BOM)
TP19  TEST POINT  [TEST_POINT_PAD_1MM]  (value not drawn)  (no BOM)
TP20  TEST POINT  [TEST_POINT_PAD_1MM]  (value not drawn)  (no BOM)
TP21  TEST POINT  [TEST_POINT_PAD_1MM]  (value not drawn)  (no BOM)
TP22  TEST POINT  [TEST_POINT_PAD_1MM]  (value not drawn)  (no BOM)
TP31  TEST POINT  [TEST_POINT_PAD_1MM]  (value not drawn)  (no BOM)
TP32  TEST POINT RED  [KS_500X_TEST_POINT]  (value not drawn)  (no BOM)
TP37  TEST POINT  [TEST_POINT_PAD_1MM]  (value not drawn)  (no BOM)
TP39  TEST POINT  [TEST_POINT_PAD_1MM]  (value not drawn)  (no BOM)
TP41  TEST POINT  [TEST_POINT_PAD_1MM]  (value not drawn)  (no BOM)
TP45  TEST POINT  [TEST_POINT_PAD_1MM]  (value not drawn)  (no BOM)
U6  CY7C65632-28LTXCT  [QFN-28]
U7  ECMF02-2AMX6  [UQFN-6L]
U8  ECMF02-2AMX6  [UQFN-6L]
U9  STMPS2141STR  [SOT23-5L]
U24  FXMA2102L8X  [UFQFN-8]
U25  M24C02-WDW6TP  [TSSOP8]

### Nets
3.0V: C80.1 C101.1 R16.2 R26.2 U24.1(VCCA) U25.8(VCC)
3.3V: C40.1 C41.1 C42.1 C43.1 C44.1 C45.1 C95.1 R15.2 R19.2 U6.5(VCC_A) U6.9(VCC_A) U6.14(VCC_A) U6.21(VCC_D) U6.28(VREG) U24.8(VCCB)
5V: C49.1 FB7.2 J9.1 R17.2 TP32.1 U9.5(IN)
GND: C40.2 C41.2 C42.2 C43.2 C44.2 C45.2 C46.2 C47.2 C48.2 C49.2 C50.2 C80.2 C95.2 C101.2 C103.2 D6.2 D7.2 D8.2 J7.4(GND) J7.5(SHIELD) J7.6(SHIELD) J7.7(SHIELD) J7.8(SHIELD) J8.5(GND) J8.6(SHIELD) J8.7(SHIELD) J8.8(SHIELD) J8.9(SHIELD) J9.5 R18.1 R20.1 R22.1 R23.1 R24.1 R27.1 TP11.1 TP13.1 TP14.1 TP15.1 TP16.1 TP17.1 TP18.1 TP19.1 TP20.1 TP21.1 TP22.1 TP37.1 TP39.1 TP41.1 TP45.1 U6.0(PAD) U7.3(GND) U7.4(NC) U8.3(GND) U8.4(NC) U9.2(GND) U24.4(GND) U25.1(E0) U25.2(E1) U25.3(E2) U25.4(VSS) U25.7(~{WC})
VBUS: C46.1 D7.1 FB7.1 J8.1(PWR) TP9.1
VBUS_ACC: C48.1 C103.1 D6.1 FB8.2 J7.1(VBUS) R12.2 TP10.1
ACC_LED_EN: D5.2(K) ; off-sheet ACC_LED_EN
ACC_PWR_EN: R16.1 U9.4(~{EN}) ; off-sheet ACC_PWR_EN
ACC_PWR_FAULT: R15.1 U6.24(OVR#[2]) U9.3(~{FAULT}) ; off-sheet ACC_PWR_FAULT
C_D2USBD_N: J7.2(D-) U7.5(D-)
C_D2USBD_P: J7.3(D+) U7.6(D+)
C_UUSBD_N: J8.2(D-) U8.2(D-)
C_UUSBD_P: J8.3(D+) U8.1(D+)
D1USBD_N: R13.2 ; off-sheet D1USBD_N
D1USBD_P: R14.2 ; off-sheet D1USBD_P
D2USBD_N: U6.6(DD-[2]) U7.2(D-)
D2USBD_P: U6.7(DD+[2]) U7.1(D+)
HUB_I2C_EN: R27.2 U24.5(OE) ; off-sheet HUB_I2C_EN
HUB_RESET: C50.1 R17.1 R20.2 U6.17(RESET#) ; off-sheet HUB_RESET
HUB_SELFPWR: R22.2 U6.22(SELFPWR) ; off-sheet HUB_SELFPWR
I2C1_SCL: R25.1 U24.2(A0) U25.6(SCL) ; off-sheet I2C1_SCL
I2C1_SDA: R26.1 U24.3(A1) U25.5(SDA) ; off-sheet I2C1_SDA
I2C_SCL_PU_EN: R25.2 ; off-sheet I2C_SCL_PU_EN
MCO: TP12.1 U6.10(XIN) ; off-sheet MCO
R_D1USBD_N: R13.1 U6.3(DD-[1])
R_D1USBD_P: R14.1 U6.4(DD+[1])
USB_SUSPEND: R23.2 U6.23(GANG) ; off-sheet USB_SUSPEND
UUSBD_N: U6.1(D-) U8.5(D-)
UUSBD_P: U6.2(D+) U8.6(D+)
WW_DETECT: D8.1 J8.4(ID) R18.2 ; off-sheet WW_DETECT
NetC47_1: C47.1 FB8.1 U9.1(OUT)
NetD5_1: D5.1(A) R12.1 TP31.1
NetJ9_2: J9.2 U6.12(DD-[3])
NetJ9_3: J9.3 U6.13(DD+[3])
NetJ9_4: J9.4 U6.20(OVR#[3])
NetR19_1: R19.1 U6.26(I2C_SDA) U24.6(B1)
NetR24_2: R24.2 U6.8(RREF)
NetU6_18: U6.18(I2C_SCL) U24.7(B0)

Not connected (* = marked no-connect by the designer): U6 11(XOUT)* 15(DD-[4])* 16(DD+[4])* 19(OVR#[4])* 25(OVR#[1])* 27(VCC)*

### Layout directives
differential pair: C_D2USBD_N, C_D2USBD_P, C_UUSBD_N, C_UUSBD_P, D1USBD_N, D1USBD_P, D2USBD_N, D2USBD_P, R_D1USBD_N, R_D1USBD_P, UUSBD_N, UUSBD_P

### Notes on the sheet
- USB HIGH SPEED HUB
- 1uF AT PIN 9 AND PIN 14
- ACCESSORY PORT
- USB TYPE A CONNECTOR
- USB MINI B CONNECTOR
- USB POWER SWITCH
- (near C48) MINIMUM 120uF FOR DOWNSTREAM VBUS PER USB 2.0 SPEC
- UNUSED USB INTERNAL BREAKOUT
- I2C BUFFER
- (near R19) NO PULLUP ON SCL PER CYPRESS SPEC
- BUS POWERED  BY DEFAULT
- INDIVIDUAL MODE BY DEFAULT
- 2Kb EEPROM
- (near U25) I2C ADDRESS = 0xA0
- TITLE
- ENGINEER
- APPROVED
- DATE
- THIS DOCUMENT IS CONFIDENTIAL AND CONTAINS DESIGNS AND OTHER INFORMATION WHICH ARE THE PROPERTY OF OCULUS VR, INC. AND MAY NOT, IN WHOLE OR IN PART, BE DUPLICATED OR DISCLOSED OR USED FOR THE MANUFACTURE OF THE PART DISCLOSED HEREIN OR FOR ANY OTHER PURPOSE WITHOUT THE PRIOR WRITTEN PERMISSION OF OCULUS VR, INC.
- SHEET DESCRIPTION
- SIZE
- PART NUMBER
- REVISION
- SHEET
- of
- B

### Library data of the parts
C40 C41 C50 = CAP, CERAMIC: as C1 on sheet VIDEO
  C50: DNP: DNP
C42-C47 C80 C95 C101 = CAP, CERAMIC: as C4 on sheet VIDEO
C48 C103 = CAP, CERAMIC: CAP, CERAMIC, 100uF, ±20%, 6.3V, X5R, 1206; Manufacturer: MURATA ELECTRONICS; Part Number: GRM31CR60J107ME39K
C49 = CAP, CERAMIC: as C3 on sheet VIDEO
D5 = LED: as D1 on sheet MICRO
D6-D8 = ESDAXLC6-1BT2: as D3 on sheet MICRO; Part Number: ESDAXLC6-1BT2
FB7 FB8 = INDUCTOR: FERRITE CHIP BEAD, 22 OHM @ 100MHz, 6A, 0805; Manufacturer: MURATA ELECTRONICS; Part Number: BLM21PG220SN1D; Package: 0805; Impedance: 22 ohm @ 100MHz
J7 = RT-USBA-F198: CONNECTOR, USB TYPE A RECEPTICLE, MID MOUNT; Manufacturer: BERWAY TECHNOLOGY; Part Number: RT-USBA-F198
J8 = BW_11163-106004-03: CONNECTOR, USB MINI B, R/A, SMD; Manufacturer: BERWAY TECHNOLOGY; Part Number: 11163-106004-03
J9 = GRPB051VWVN-RC: CONNECTOR, HEADER, 1X5, 0.05" PITCH; Manufacturer: SULLINS CONNECTOR; Part Number: GRPB051VWVN-RC; DNP: DNP
R12 = RESISTOR: as R7 on sheet MICRO; Power Rating: 1/10W
R13 R14 = RESISTOR: as R11 on sheet MICRO; Power Rating: 1/10W; Package: 0402; Tolerance: ±1%
R15 R17 R19 R27 = RESISTOR: as R21 on sheet VIDEO; Power Rating: 1/10W
  R17: DNP: DNP
R16 R22 R23 = RESISTOR: as R10 on sheet MICRO; Power Rating: 1/10W
R18 = RESISTOR: RES, 1M OHM, 1/10W, ±1%, 0402; Manufacturer: PANASONIC; Part Number: ERJ-2RKF1004X; Power Rating: 1/10W
R20 = RESISTOR: as R5 on sheet VIDEO; Power Rating: 1/10W
R24 = RESISTOR: RES, 649 OHM, 1/10W, ±1%, 0402; Manufacturer: PANASONIC; Part Number: ERJ-2RKF6490X; Power Rating: 1/10W
R25 R26 = RESISTOR: as R1 on sheet VIDEO; Power Rating: 1/10W
TP9 TP10 TP12 TP13 TP19-TP22 TP31 TP37 TP39 TP41 TP45 = TEST_POINT_GENERIC: Manufacturer: *; Part Number: *
TP11 TP14-TP18 = TEST_POINT_BLACK: Manufacturer: KEYSTONE ELECTRONICS; Part Number: 5001
TP32 = TEST_POINT_RED: Manufacturer: KEYSTONE ELECTRONICS; Part Number: 5000
U6 = CY7C65632-28LTXCT: IC, USB 2.0 HUB CONTROLLER, 4-PORT, STT; Manufacturer: CYPRESS SEMICONDUCTOR; Part Number: CY7C65632-28LTXCT; Verified Pinout: *
U7 U8 = ECMF02-2AMX6: IC, COMMON MODE FILTER WITH ESD PROTECTION FOR MIPI; Manufacturer: STMICROELECTRONICS; Part Number: ECMF02-2AMX6; Verified Pinout: *
U9 = STMPS2141STR: IC, USB POWER DISTRIBUTION SWITCH, 500mA CURRENT LIMIT; Manufacturer: STMICROELECTRONICS; Part Number: STMPS2141STR; Pinout verified: *
U24 = FXMA2102L8X: IC, I2C TRANSLATOR, BUFFER AND REPEATER; Manufacturer: FAIRCHILD SEMICONDUCTOR; Part Number: FXMA2102L8X; Verified Pinout: *
U25 = M24C02-WDW6TP: IC, EEPROM, I2C, 2kB; Manufacturer: STMICROELECTRONICS; Part Number: M24C02-WDW6TP; Verified Pinout: *

## Sheet SENSOR.SchDoc: OCULUS RIFT DEVELOPMENT KIT 2 (DK2) MAIN BOARD
size B; Date: 12 MAR 2014; Author: L. BAINBRIDGE; CompanyName: Oculus VR, Inc.; DrawnBy: L. BAINBRIDGE; Engineer: L. BAINBRIDGE; Organization: Oculus VR, Inc.; DocumentNumber: 4; Revision: 3.3; SheetNumber: 4; SheetTotal: 6; PageSetup: Record=PageOptions|CenterHorizontal=True|CenterVertical=True|PrintScale=1.12|XCorrection=1.00|YCorrection=1.00|PrintKind=1|BorderSize=5000000|LeftOffset=0|BottomOffset=0|Orientation=2|PaperLength=1000|PaperWidth=1000|Scale=100|PaperSource=15|PrintQuality=1200|MediaType=1|DitherType=0|PaperKind=11 x 17|PrintScaleMode=1; SheetDescription: 3-AXIS GYROSCOPE, ACCELEROMETER AND MAGNETOMETER; PartNumber: N/A; ProjectName: DK2
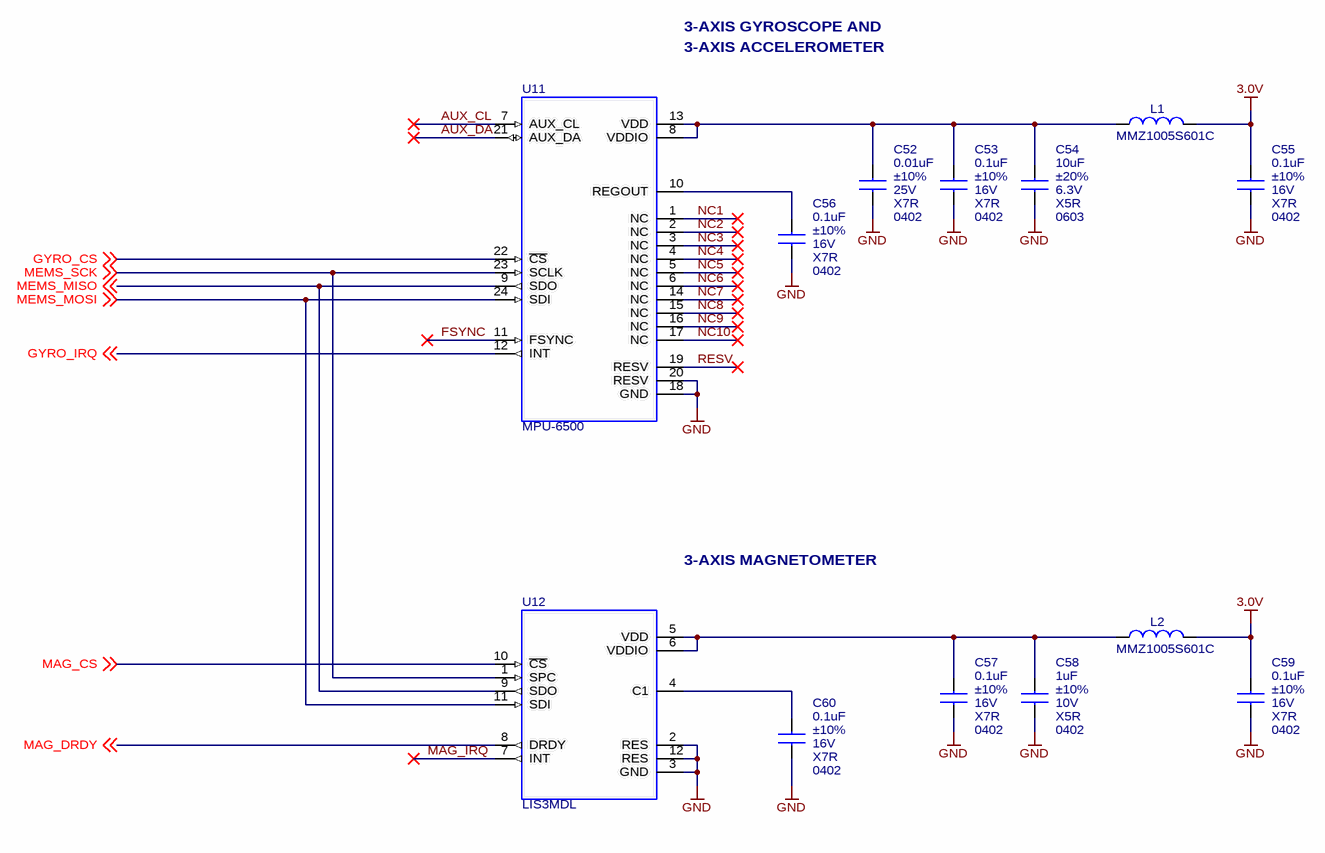
[diagram p3: SENSOR.SchDoc]

### Parts
C52  0.01uF  Tolerance: ±10%  Voltage: 25V  Dielectric: X7R  Package: 0402  [CAP_CERAMIC_0402]
C53  0.1uF  Tolerance: ±10%  Voltage: 16V  Dielectric: X7R  Package: 0402  [CAP_CERAMIC_0402]
C54  10uF  Tolerance: ±20%  Voltage: 6.3V  Dielectric: X5R  Package: 0603  [CAP_CERAMIC_0603]
C55  0.1uF  Tolerance: ±10%  Voltage: 16V  Dielectric: X7R  Package: 0402  [CAP_CERAMIC_0402]
C56  0.1uF  Tolerance: ±10%  Voltage: 16V  Dielectric: X7R  Package: 0402  [CAP_CERAMIC_0402]
C57  0.1uF  Tolerance: ±10%  Voltage: 16V  Dielectric: X7R  Package: 0402  [CAP_CERAMIC_0402]
C58  1uF  Tolerance: ±10%  Voltage: 10V  Dielectric: X5R  Package: 0402  [CAP_CERAMIC_0402]
C59  0.1uF  Tolerance: ±10%  Voltage: 16V  Dielectric: X7R  Package: 0402  [CAP_CERAMIC_0402]
C60  0.1uF  Tolerance: ±10%  Voltage: 16V  Dielectric: X7R  Package: 0402  [CAP_CERAMIC_0402]
L1  MMZ1005S601C  [INDUCTOR_0402]
L2  MMZ1005S601C  [INDUCTOR_0402]
U11  MPU-6500  [QFN-24]
U12  LIS3MDL  [LGA-12]

### Nets
3.0V: C55.1 C59.1 L1.2 L2.2
GND: C52.2 C53.2 C54.2 C55.2 C56.2 C57.2 C58.2 C59.2 C60.2 U11.18(GND) U11.20(RESV) U12.2(RES) U12.3(GND) U12.12(RES)
AUX_CL: U11.7(AUX_CL)
AUX_DA: U11.21(AUX_DA)
FSYNC: U11.11(FSYNC)
GYRO_CS: U11.22(~{CS}) ; off-sheet GYRO_CS
GYRO_IRQ: U11.12(INT) ; off-sheet GYRO_IRQ
MAG_CS: U12.10(~{CS}) ; off-sheet MAG_CS
MAG_DRDY: U12.8(DRDY) ; off-sheet MAG_DRDY
MAG_IRQ: U12.7(INT)
MEMS_MISO: U11.9(SDO) U12.9(SDO) ; off-sheet MEMS_MISO
MEMS_MOSI: U11.24(SDI) U12.11(SDI) ; off-sheet MEMS_MOSI
MEMS_SCK: U11.23(SCLK) U12.1(SPC) ; off-sheet MEMS_SCK
NC1: U11.1(NC)
NC2: U11.2(NC)
NC3: U11.3(NC)
NC4: U11.4(NC)
NC5: U11.5(NC)
NC6: U11.6(NC)
NC7: U11.14(NC)
NC8: U11.15(NC)
NC9: U11.16(NC)
NC10: U11.17(NC)
RESV: U11.19(RESV)
NetC52_1: C52.1 C53.1 C54.1 L1.1 U11.8(VDDIO) U11.13(VDD)
NetC56_1: C56.1 U11.10(REGOUT)
NetC57_1: C57.1 C58.1 L2.1 U12.5(VDD) U12.6(VDDIO)
NetC60_1: C60.1 U12.4(C1)

### Notes on the sheet
- 3-AXIS GYROSCOPE AND
- 3-AXIS ACCELEROMETER
- 3-AXIS MAGNETOMETER
- TITLE
- ENGINEER
- APPROVED
- DATE
- THIS DOCUMENT IS CONFIDENTIAL AND CONTAINS DESIGNS AND OTHER INFORMATION WHICH ARE THE PROPERTY OF OCULUS VR, INC. AND MAY NOT, IN WHOLE OR IN PART, BE DUPLICATED OR DISCLOSED OR USED FOR THE MANUFACTURE OF THE PART DISCLOSED HEREIN OR FOR ANY OTHER PURPOSE WITHOUT THE PRIOR WRITTEN PERMISSION OF OCULUS VR, INC.
- SHEET DESCRIPTION
- SIZE
- PART NUMBER
- REVISION
- SHEET
- of
- B

### Library data of the parts
C52 = CAP, CERAMIC: as C2 on sheet VIDEO
C53 C55-C57 C59 C60 = CAP, CERAMIC: as C4 on sheet VIDEO
C54 = CAP, CERAMIC: as C3 on sheet VIDEO
C58 = CAP, CERAMIC: as C1 on sheet VIDEO
L1 L2 = INDUCTOR: FERRITE CHIP BEAD, 600 OHM @ 100MHz, 300mA, 0402; Manufacturer: TDK CORPORATION; Part Number: MMZ1005S601C; Package: 0402
U11 = MPU-6500: IC, MEMS 3 AXIS GYROSCOPE AND 3 AXIS ACCELEROMETER; Manufacturer: INVENSENSE; Part Number: MPU-6500; Verified Pinout: *; Updated: *
U12 = LIS3MDL: IC, MEMS 3 AXIS MAGNETOMETER; Manufacturer: STMICROELECTRONICS; Part Number: LIS3MDLTR; Verified Pinout: *

## Sheet POWER.SchDoc: OCULUS RIFT DEVELOPMENT KIT 2 (DK2) MAIN BOARD
size B; Date: 12 MAR 2014; Author: L. BAINBRIDGE; CompanyName: Oculus VR, Inc.; DrawnBy: L. BAINBRIDGE; Engineer: L. BAINBRIDGE; Organization: Oculus VR, Inc.; DocumentNumber: 5; Revision: 3.3; SheetNumber: 5; SheetTotal: 6; PageSetup: Record=PageOptions|CenterHorizontal=True|CenterVertical=True|PrintScale=1.12|XCorrection=1.00|YCorrection=1.00|PrintKind=1|BorderSize=5000000|LeftOffset=0|BottomOffset=0|Orientation=2|PaperLength=1000|PaperWidth=1000|Scale=100|PaperSource=15|PrintQuality=1200|MediaType=1|DitherType=0|PaperKind=11 x 17|PrintScaleMode=1; SheetDescription: 3.3V/1.2V SUPPLY, 3.0V LDO, LOAD SWITCHING AND AMOLED SUPPLY; PartNumber: N/A; ProjectName: DK2
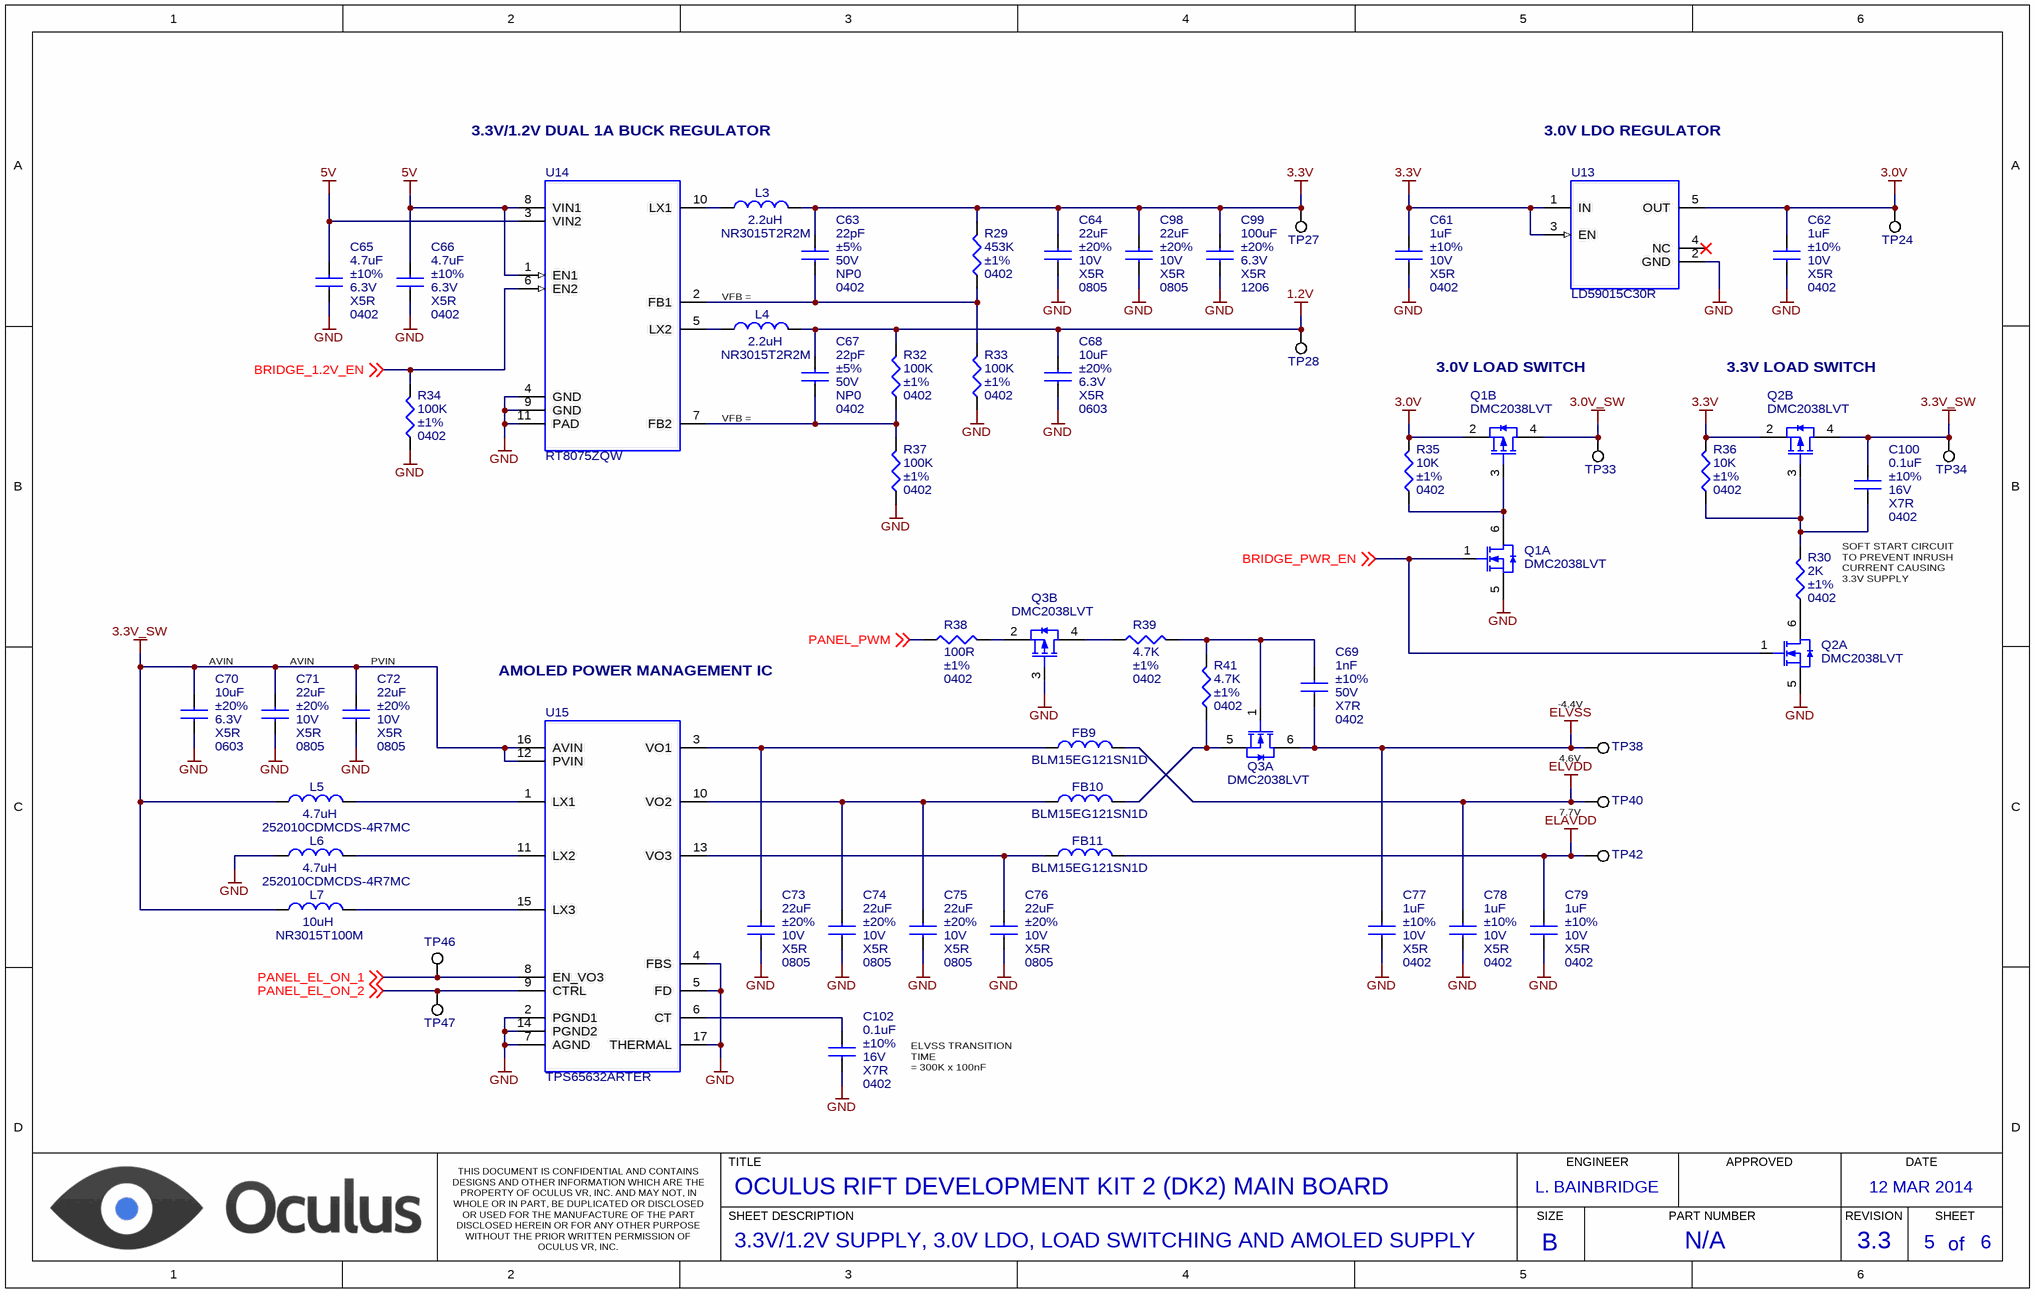
[diagram p4: POWER.SchDoc]

### Parts
C61  1uF  Tolerance: ±10%  Voltage: 10V  Dielectric: X5R  Package: 0402  [CAP_CERAMIC_0402]
C62  1uF  Tolerance: ±10%  Voltage: 10V  Dielectric: X5R  Package: 0402  [CAP_CERAMIC_0402]
C63  22pF  Tolerance: ±5%  Voltage: 50V  Dielectric: NP0  Package: 0402  [CAP_CERAMIC_0402]
C64  22uF  Tolerance: ±20%  Voltage: 10V  Dielectric: X5R  Package: 0805  [CAP_CERAMIC_0805]
C65  4.7uF  Tolerance: ±10%  Voltage: 6.3V  Dielectric: X5R  Package: 0402  [CAP_CERAMIC_0402]
C66  4.7uF  Tolerance: ±10%  Voltage: 6.3V  Dielectric: X5R  Package: 0402  [CAP_CERAMIC_0402]
C67  22pF  Tolerance: ±5%  Voltage: 50V  Dielectric: NP0  Package: 0402  [CAP_CERAMIC_0402]
C68  10uF  Tolerance: ±20%  Voltage: 6.3V  Dielectric: X5R  Package: 0603  [CAP_CERAMIC_0603]
C69  1nF  Tolerance: ±10%  Voltage: 50V  Dielectric: X7R  Package: 0402  [CAP_CERAMIC_0402]
C70  10uF  Tolerance: ±20%  Voltage: 6.3V  Dielectric: X5R  Package: 0603  [CAP_CERAMIC_0603]
C71  22uF  Tolerance: ±20%  Voltage: 10V  Dielectric: X5R  Package: 0805  [CAP_CERAMIC_0805]
C72  22uF  Tolerance: ±20%  Voltage: 10V  Dielectric: X5R  Package: 0805  [CAP_CERAMIC_0805]
C73  22uF  Tolerance: ±20%  Voltage: 10V  Dielectric: X5R  Package: 0805  [CAP_CERAMIC_0805]
C74  22uF  Tolerance: ±20%  Voltage: 10V  Dielectric: X5R  Package: 0805  [CAP_CERAMIC_0805]
C75  22uF  Tolerance: ±20%  Voltage: 10V  Dielectric: X5R  Package: 0805  [CAP_CERAMIC_0805]
C76  22uF  Tolerance: ±20%  Voltage: 10V  Dielectric: X5R  Package: 0805  [CAP_CERAMIC_0805]
C77  1uF  Tolerance: ±10%  Voltage: 10V  Dielectric: X5R  Package: 0402  [CAP_CERAMIC_0402]
C78  1uF  Tolerance: ±10%  Voltage: 10V  Dielectric: X5R  Package: 0402  [CAP_CERAMIC_0402]
C79  1uF  Tolerance: ±10%  Voltage: 10V  Dielectric: X5R  Package: 0402  [CAP_CERAMIC_0402]
C98  22uF  Tolerance: ±20%  Voltage: 10V  Dielectric: X5R  Package: 0805  [CAP_CERAMIC_0805]
C99  100uF  Tolerance: ±20%  Voltage: 6.3V  Dielectric: X5R  Package: 1206  [CAP_CERAMIC_1206]  (no BOM)
C100  0.1uF  Tolerance: ±10%  Voltage: 16V  Dielectric: X7R  Package: 0402  [CAP_CERAMIC_0402]
C102  0.1uF  Tolerance: ±10%  Voltage: 16V  Dielectric: X7R  Package: 0402  [CAP_CERAMIC_0402]
FB9  BLM15EG121SN1D  [INDUCTOR_0402]
FB10  BLM15EG121SN1D  [INDUCTOR_0402]
FB11  BLM15EG121SN1D  [INDUCTOR_0402]
L3  2.2uH  Part Number: NR3015T2R2M  [NR3015]
L4  2.2uH  Part Number: NR3015T2R2M  [NR3015]
L5  4.7uH  Part Number: 252010CDMCDS-4R7MC  [252010CDMCDS]
L6  4.7uH  Part Number: 252010CDMCDS-4R7MC  [252010CDMCDS]
L7  10uH  Part Number: NR3015T100M  [NR3015]
Q1  DMC2038LVT  [TSOT26]  (parts A,B of 2)
Q2  DMC2038LVT  [TSOT26]  (parts A,B of 2)
Q3  DMC2038LVT  [TSOT26]  (parts A,B of 2)
R29  453K  Package: 0402  Tolerance: ±1%  [RESISTOR_0402]
R30  2K  Package: 0402  Tolerance: ±1%  [RESISTOR_0402]
R32  100K  Package: 0402  Tolerance: ±1%  [RESISTOR_0402]
R33  100K  Package: 0402  Tolerance: ±1%  [RESISTOR_0402]
R34  100K  Package: 0402  Tolerance: ±1%  [RESISTOR_0402]
R35  10K  Package: 0402  Tolerance: ±1%  [RESISTOR_0402]
R36  10K  Package: 0402  Tolerance: ±1%  [RESISTOR_0402]
R37  100K  Package: 0402  Tolerance: ±1%  [RESISTOR_0402]
R38  100R  Package: 0402  Tolerance: ±1%  [RESISTOR_0402]
R39  4.7K  Package: 0402  Tolerance: ±1%  [RESISTOR_0402]
R41  4.7K  Package: 0402  Tolerance: ±1%  [RESISTOR_0402]
TP24  TEST POINT  [TEST_POINT_PAD_1.2X3MM]  (value not drawn)  (no BOM)
TP27  TEST POINT  [TEST_POINT_PAD_1MM]  (value not drawn)  (no BOM)
TP28  TEST POINT  [TEST_POINT_PAD_1MM]  (value not drawn)  (no BOM)
TP33  TEST POINT  [TEST_POINT_PAD_1MM]  (value not drawn)  (no BOM)
TP34  TEST POINT  [TEST_POINT_PAD_1MM]  (value not drawn)  (no BOM)
TP38  TEST POINT  [TEST_POINT_PAD_1MM]  (value not drawn)  (no BOM)
TP40  TEST POINT  [TEST_POINT_PAD_1MM]  (value not drawn)  (no BOM)
TP42  TEST POINT  [TEST_POINT_PAD_1MM]  (value not drawn)  (no BOM)
TP46  TEST POINT  [TEST_POINT_PAD_1MM]  (value not drawn)  (no BOM)
TP47  TEST POINT  [TEST_POINT_PAD_1MM]  (value not drawn)  (no BOM)
U13  LD59015C30R  [SOT323-5L]
U14  RT8075ZQW  [WDFN-10L]
U15  TPS65632ARTER  [S-PWQFN-N16]

### Nets
1.2V: C67.1 C68.1 L4.1 R32.2 TP28.1
3.0V: C62.1 Q1.2(S) R35.2 TP24.1 U13.5(OUT)
3.0V_SW: Q1.4(D) TP33.1
3.3V: C61.1 C63.1 C64.1 C98.1 C99.1 L3.1 Q2.2(S) R29.2 R36.2 TP27.1 U13.1(IN) U13.3(EN)
3.3V_SW: C70.1 C71.1 C72.1 C100.1 L5.2 L7.2 Q2.4(D) TP34.1 U15.12(PVIN) U15.16(AVIN)
5V: C65.1 C66.1 U14.1(EN1) U14.3(VIN2) U14.8(VIN1)
ELAVDD: C79.1 FB11.2 TP42.1
ELVDD: C78.1 FB9.2 TP40.1
ELVSS: C69.1 C77.1 Q3.6(D) TP38.1
GND: C61.2 C62.2 C64.2 C65.2 C66.2 C68.2 C70.2 C71.2 C72.2 C73.2 C74.2 C75.2 C76.2 C77.2 C78.2 C79.2 C98.2 C99.2 C102.2 L6.2 Q1.5(S) Q2.5(S) Q3.3(G) R33.1 R34.1 R37.1 U13.2(GND) U14.4(GND) U14.9(GND) U14.11(PAD) U15.2(PGND1) U15.4(FBS) U15.5(FD) U15.7(AGND) U15.14(PGND2) U15.17(THERMAL)
BRIDGE_1.2V_EN: R34.2 U14.6(EN2) ; off-sheet BRIDGE_1.2V_EN
BRIDGE_PWR_EN: Q1.1(G) Q2.1(G) ; off-sheet BRIDGE_PWR_EN
PANEL_EL_ON_1: TP46.1 U15.8(EN_VO3) ; off-sheet PANEL_EL_ON_1
PANEL_EL_ON_2: TP47.1 U15.9(CTRL) ; off-sheet PANEL_EL_ON_2
PANEL_PWM: R38.1 ; off-sheet PANEL_PWM
NetC63_2: C63.2 R29.1 R33.2 U14.2(FB1)
NetC67_2: C67.2 R32.1 R37.2 U14.7(FB2)
NetC69_2: C69.2 Q3.1(G) R39.2 R41.2
NetC73_1: C73.1 FB9.1 U15.3(VO1)
NetC74_1: C74.1 C75.1 FB10.1 U15.10(VO2)
NetC76_1: C76.1 FB11.1 U15.13(VO3)
NetC100_2: C100.2 Q2.3(G) R30.2 R36.1
NetC102_1: C102.1 U15.6(CT)
NetFB10_2: FB10.2 Q3.5(S) R41.1
NetL3_2: L3.2 U14.10(LX1)
NetL4_2: L4.2 U14.5(LX2)
NetL5_1: L5.1 U15.1(LX1)
NetL6_1: L6.1 U15.11(LX2)
NetL7_1: L7.1 U15.15(LX3)
NetQ1_3: Q1.3(G) Q1.6(D) R35.1
NetQ2_6: Q2.6(D) R30.1
NetQ3_2: Q3.2(S) R38.2
NetQ3_4: Q3.4(D) R39.1

Not connected (* = marked no-connect by the designer): U13 4(NC)*

### Notes on the sheet
- 3.3V/1.2V DUAL 1A BUCK REGULATOR
- 3.0V LDO REGULATOR
- VFB = 0.6V
- 3.0V LOAD SWITCH
- 3.3V LOAD SWITCH
- SOFT START CIRCUIT TO PREVENT INRUSH CURRENT CAUSING 3.3V SUPPLY VOLTAGE DROP
- AVIN
- (near C72) PVIN
- AMOLED POWER MANAGEMENT IC
- (near TP38) -4.4V
- (near TP38) 4.6V
- (near TP40) 7.7V
- ELVSS TRANSITION TIME
  = 300K x 100nF
  = 30ms
- TITLE
- ENGINEER
- APPROVED
- DATE
- THIS DOCUMENT IS CONFIDENTIAL AND CONTAINS DESIGNS AND OTHER INFORMATION WHICH ARE THE PROPERTY OF OCULUS VR, INC. AND MAY NOT, IN WHOLE OR IN PART, BE DUPLICATED OR DISCLOSED OR USED FOR THE MANUFACTURE OF THE PART DISCLOSED HEREIN OR FOR ANY OTHER PURPOSE WITHOUT THE PRIOR WRITTEN PERMISSION OF OCULUS VR, INC.
- SHEET DESCRIPTION
- SIZE
- PART NUMBER
- REVISION
- SHEET
- of
- B

### Library data of the parts
C61 C62 C77-C79 = CAP, CERAMIC: as C1 on sheet VIDEO
C63 C67 = CAP, CERAMIC: CAP, CERAMIC, 22pF, ±5%, 50V, NP0, 0402; Manufacturer: MURATA ELECTRONICS; Part Number: GRM1535C1H220JDD5D
C64 C71-C76 C98 = CAP, CERAMIC: CAP, CERAMIC, 22uF, ±20%, 10V, X5R, 0805; Manufacturer: SAMSUNG; Part Number: CL21A226MPQNNNE
C65 C66 = CAP, CERAMIC: as C28 on sheet MICRO
C68 C70 = CAP, CERAMIC: as C3 on sheet VIDEO
C69 = CAP, CERAMIC: CAP, CERAMIC, 1nF, ±10%, 50V, X7R, 0402; Manufacturer: MURATA ELECTRONICS; Part Number: GRM155R71H102KA01D
C99 = CAP, CERAMIC: as C48 on sheet USBHUB; DNP: DNP
C100 C102 = CAP, CERAMIC: as C4 on sheet VIDEO
FB9-FB11 = INDUCTOR: FERRITE CHIP BEAD, 120 OHM @ 100MHz, 1.5A, 0402; Manufacturer: MURATA ELECTRONICS; Impedance: 22 ohm @ 100MHz; Part Number: BLM15EG121SN1D; Package: 0402
L3 L4 = INDUCTOR: INDUCTOR, SHIELDED POWER, 2.2uH, 1.5A; Manufacturer: TAIYO YUDEN
L5 L6 = INDUCTOR: INDUCTOR, SHIELDED POWER, 4.7uH, 1.4A; Manufacturer: SUMIDA
L7 = INDUCTOR: INDUCTOR, SHIELDED POWER, 10uH, 730mA; Manufacturer: TAIYO YUDEN
Q1-Q3 = DMC2038LVT: as Q6 on sheet VIDEO; Part Number: DMC2038LVT
R29 = RESISTOR: RES, 453K OHM, 1/10W, ±1%, 0402; Manufacturer: PANASONIC; Part Number: ERJ-2RKF4533X; Power Rating: 1/10W
R30 = RESISTOR: as R1 on sheet VIDEO; Power Rating: 1/10W
R32-R34 R37 = RESISTOR: as R10 on sheet MICRO; Power Rating: 1/10W
R35 R36 = RESISTOR: as R21 on sheet VIDEO; Power Rating: 1/10W
R38 = RESISTOR: RES, 100 OHM, 1/10W, ±1%, 0402; Manufacturer: PANASONIC; Part Number: ERJ-2RKF1000X; Power Rating: 1/10W
R39 R41 = RESISTOR: RES, 4.7K OHM, 1/10W, ±1%, 0402; Manufacturer: PANASONIC; Part Number: ERJ-2RKF4701X; Power Rating: 1/10W
TP24 TP27 TP28 TP33 TP34 TP38 TP40 TP42 TP46 TP47 = TEST_POINT_GENERIC: Manufacturer: *; Part Number: *
U13 = LD59015C30R: IC, LDO REGULATOR, 3.0V, 150mA, HIGH PSRR; Manufacturer: STMICROELECTRONICS; Part Number: LD59015C30R; Pinout verified: *
U14 = RT8075ZQW: IC, DUAL STEP DOWN CONVERTER, 1A, 1.25MHz; Manufacturer: RICHTEK; Part Number: RT8075ZQW; Pinout verified: *
U15 = TPS65632ARTER: IC, TRIPLE OUTPUT AMOLED DISPLAY POWER SUPPLY; Manufacturer: TEXAS INSTRUMENTS; Part Number: TPS65632ARTER